# EasyEDA Pro project Flow Meter 3.eprj

# Schematic Schematic1

## Sheets
1 P1: Board Name: Board1; Create Date: 2024-12-02; Page Name: P1; Project Name: Flow Meter 3; Schematic Name: Schematic1; Update Date: 2024-12-02; Company: EasyEDA.com; Drawn: EasyEDA; Page Size: A4; Part Number: JLCPCB-002; Reviewed: EasyEDA; Version: V0.1
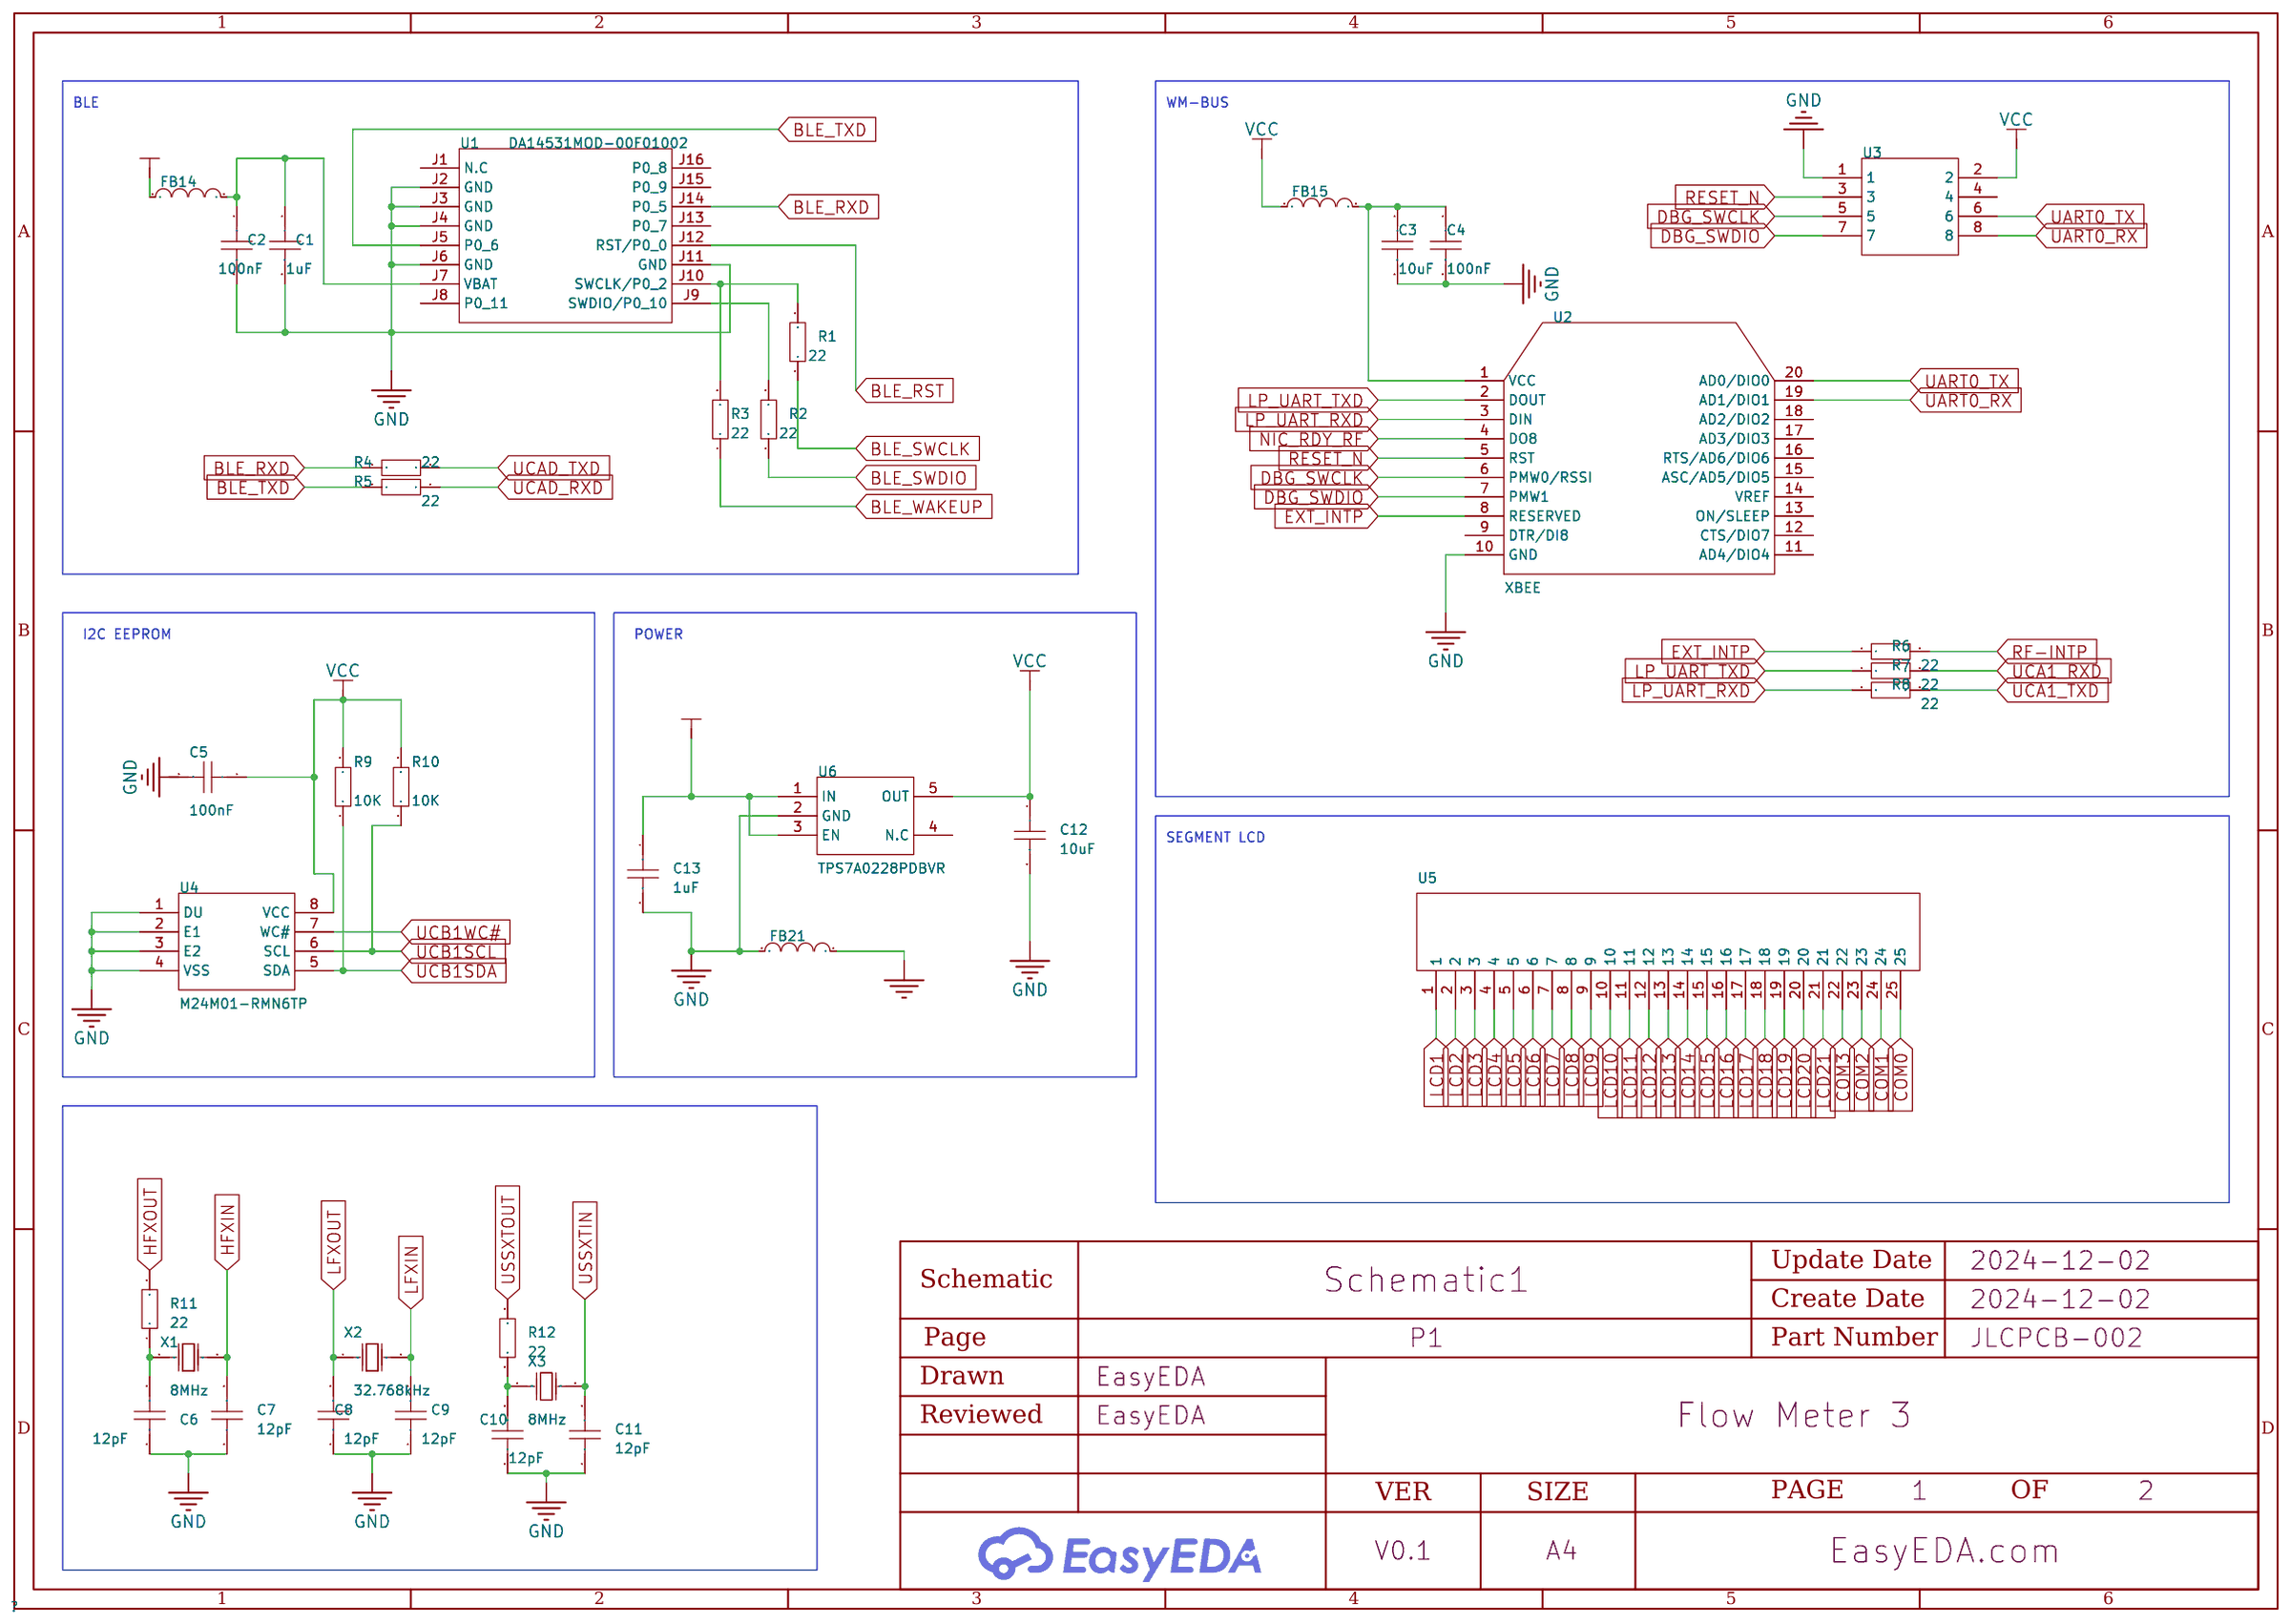
[diagram p0: P1]
2 P2: Page Name: P2; Update Date: 2024-12-03
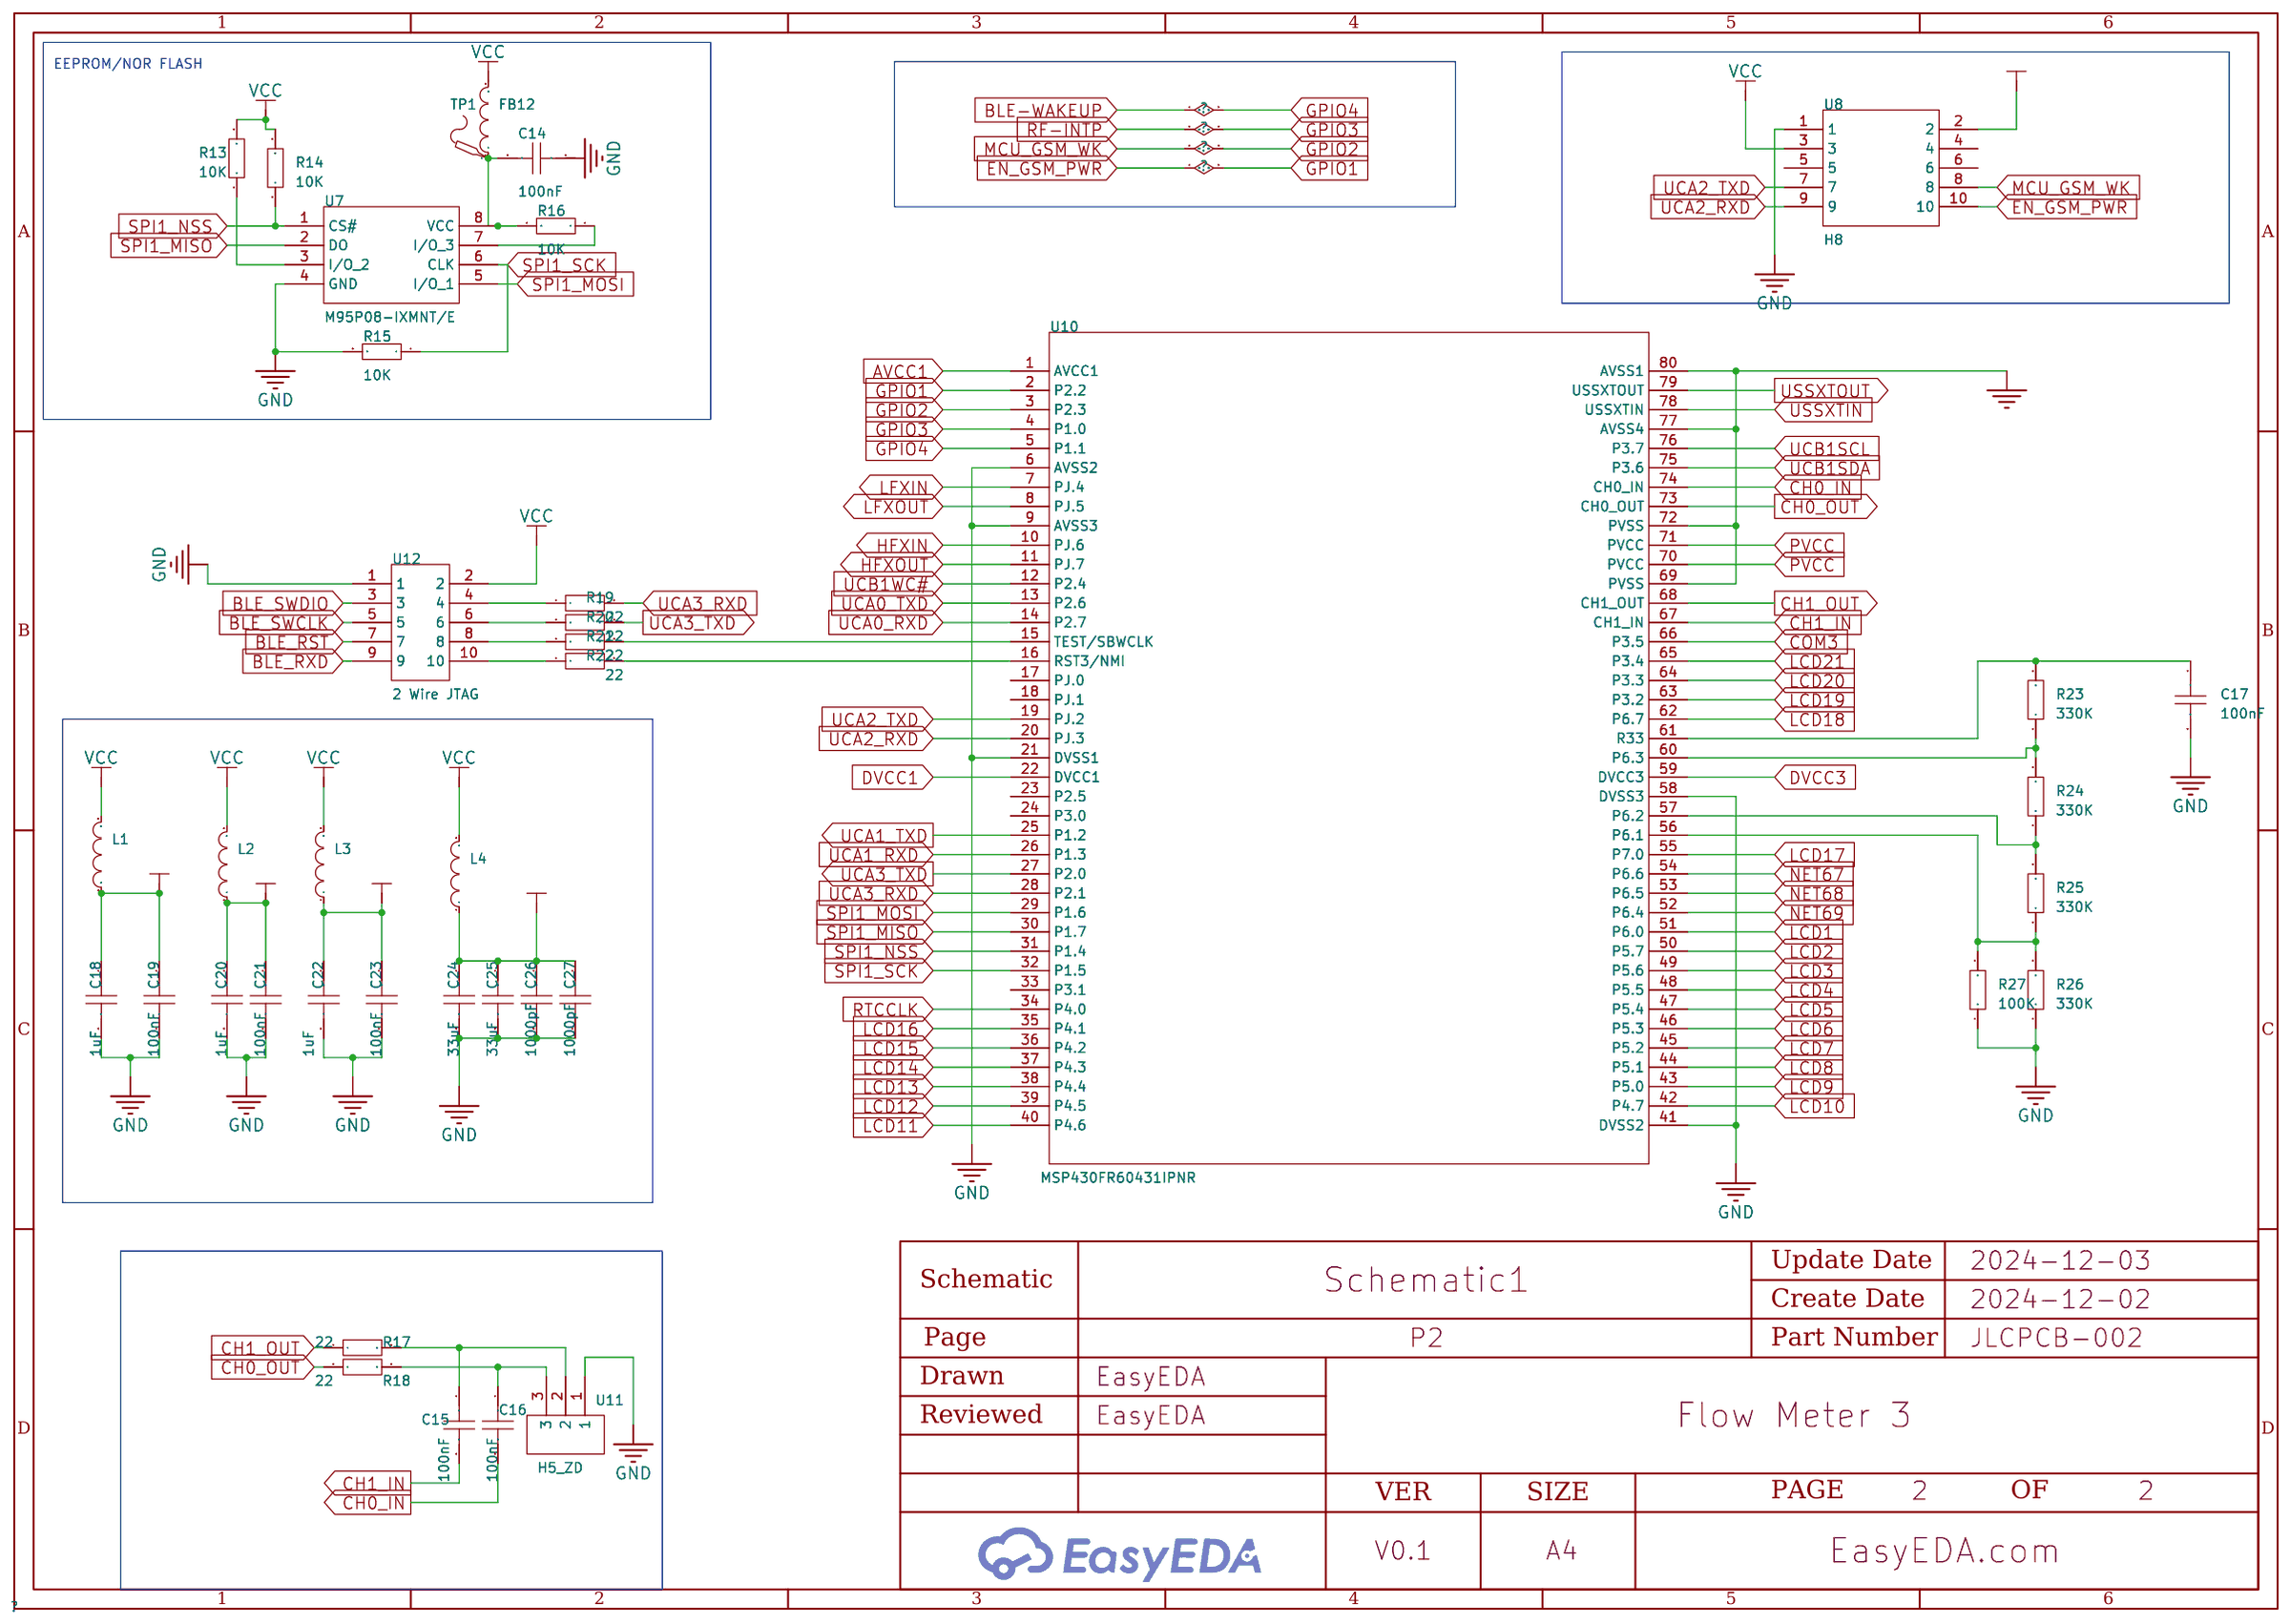
[diagram p1: P2]

## Parts
sheet P1
C1  1uF  [C0603]
C2  100nF  [C0603]
C3  10uF  [C0603]
C4  100nF  [C0603]
C5  100nF  [C0603]
C6  12pF  [C0603]
C7  12pF  [C0603]
C8  12pF  [C0603]
C9  12pF  [C0603]
C10  12pF  [C0603]
C11  12pF  [C0603]
C12  10uF  [C0603]
C13  1uF  [C0603]
FB14  10uH  [L0603]
FB15  10uH  [L0603]
FB21  10uH  [L0603]
R1  22  [R0603]
R2  22  [R0603]
R3  22  [R0603]
R4  22  [R0603]
R5  22  [R0603]
R6  22  [R0603]
R7  22  [R0603]
R8  22  [R0603]
R9  10K  [R0603]
R10  10K  [R0603]
R11  22  [R0603]
R12  22  [R0603]
U1  DA14531MOD-00F01002
U2  XBEE  [XBEE]
U3  -
U4  M24M01-RMN6TP
U5  -  [SEGMENT LCD]
U6  TPS7A0228PDBVR
X1  8MHz  [CRYSTAL-SMD_L11.5-W4.8-LS12.7]
X2  32.768kHz  [CRYSTAL-SMD_L11.5-W4.8-LS12.7]
X3  8MHz  [CRYSTAL-SMD_L11.5-W4.8-LS12.7]
sheet P2
C14  100nF  [C0603]
C15  100nF  [C0603]
C16  100nF  [C0603]
C17  100nF  [C0603]
C18  1uF  [C0603]
C19  100nF  [C0603]
C20  1uF  [C0603]
C21  100nF  [C0603]
C22  1uF  [C0603]
C23  100nF  [C0603]
C24  33uF  [C0603]
C25  33uF  [C0603]
C26  1000pF  [C0603]
C27  1000pF  [C0603]
FB12  10uH  [L0603]
L1  10uH  [L0603]
L2  10uH  [L0603]
L3  10uH  [L0603]
L4  10uH  [L0603]
R13  10K  [R0603]
R14  10K  [R0603]
R15  10K  [R0603]
R16  10K  [R0603]
R17  22  [R0603]
R18  22  [R0603]
R19  22  [R0603]
R20  22  [R0603]
R21  22  [R0603]
R22  22  [R0603]
R23  330K  [R0603]
R24  330K  [R0603]
R25  330K  [R0603]
R26  330K  [R0603]
R27  100K  [R0603]
TP1  -  [Test-Point-0.5mm]
U7  M95P08-IXMNT/E  [EEPROM/NOR FLASH]
U8  H8  [H8]
U10  MSP430FR60431IPNR  [MICROCONTROLLER]
U11  H5_ZD  [H5]
U12  2 Wire JTAG  [JTAG]

## Library data of the parts
C1-C27 = CAP_0603: Supplier Footprint: 0603
FB12 FB14 FB15 FB21 L1-L4 = L_0603
R1-R27 = Res_0603: Supplier Footprint: 0603
U1 = BLE
U2 = WM-BUS
U3 = PZ127V-12-08-0720
U4 = I2C EEPROM
U5 = SEGMENT LCD
U6 = POWER
X1-X3 = X49SM8MSD2SC: Crystal Type:Surface Mount Crystal Frequency: Normal temperature Frequency Tolerance:±20ppm Normal temperature Frequency Tolerance:±20ppm External load capacitor: Frequency Stability(Full temperature range):±30ppm Frequency Stability(Full temperature rang; LCSC Part Name: 8MHz ±20ppm 20pF; Supplier Part: C12674; Manufacturer: YXC(扬兴晶振); Supplier Footprint: HC-49S-SMD; JLCPCB Part Class: Basic Part; Datasheet: https://atta.szlcsc.com/upload/public/pdf/source/20240329/3EBF42EBCAB50CA65B6FA9D7CFA1955A.pdf; Supplier: LCSC; Crystal Type: Surface Mount Crystal; Normal temperature Frequency Tolerance: ±20ppm; Frequency Stability(Full temperature range): ±30ppm
TP1 = Test-Point: Test Point 测试点
U7 = EEPROM/NOR FLASH
U8 = IO EXP
U10 = MSP430FR60431IPNR
U11 = H5_ZD
U12 = 2 Wire JTAG

## Nets
AVCC1: C18.1 C19.1 L1.1 U10.1(AVCC1)
DVCC1: C20.1 C21.1 L2.1 U10.22(DVCC1)
DVCC3: C22.1 C23.1 L3.1 U10.59(DVCC3)
GND: C1.2 C2.2 C3.2 C4.2 C5.2 C6.1 C7.1 C8.1 C9.1 C10.1 C11.1 C12.2 C13.2 C14.1 C17.2 C18.2 C19.2 C20.2 C21.2 C22.2 C23.2 C24.2 C25.2 C26.2 C27.2 FB21.1 R15.2 R26.1 R27.1 U1.J2(GND) U1.J3(GND) U1.J4(GND) U1.J6(GND) U1.J11(GND) U2.10(GND) U3.1 U4.1(DU) U4.2(E1) U4.3(E2) U4.4(VSS) U6.2(GND) U7.4(GND) U8.1 U10.6(AVSS2) U10.9(AVSS3) U10.21(DVSS1) U10.41(DVSS2) U10.58(DVSS3) U11.1 U12.1
PVCC: C24.1 C25.1 C26.1 C27.1 L4.1 U10.70(PVCC) U10.71(PVCC)
VBAT: C13.1 U6.1(IN) U6.3(EN) U8.2
VCC: C5.1 C12.1 FB12.2 FB15.1 L1.2 L2.2 L3.2 L4.2 R9.2 R10.2 R13.2 R14.2 U3.2 U4.8(VCC) U6.5(OUT) U8.3 U12.2
VDD_2V8: FB14.1
BLE-WAKEUP: U10.5(P1.1)
BLE_RST: U1.J12(RST/P0_0) U12.7
BLE_RXD: R4.1 U1.J14(P0_5) U12.9
BLE_SWCLK: R1.1 U12.5
BLE_SWDIO: R2.1 U12.3
BLE_TXD: R5.1 U1.J5(P0_6)
BLE_WAKEUP: R3.1
CH0_IN: C16.2 U10.74(CH0_IN)
CH0_OUT: R18.1 U10.73(CH0_OUT)
CH1_IN: C15.2 U10.67(CH1_IN)
CH1_OUT: R17.1 U10.68(CH1_OUT)
COM0: U5.25
COM1: U5.24
COM2: U5.23
COM3: U5.22 U10.66(P3.5)
DBG_SWCLK: U2.6(PMW0/RSSI) U3.5
DBG_SWDIO: U2.7(PMW1) U3.7
EN_GSM_PWR: U8.10 U10.2(P2.2)
EXT_INTP: R6.1 U2.8(RESERVED)
GPIO2: U8.8 U10.3(P2.3)
GPIO3: R6.2 U10.4(P1.0)
HFXIN: C7.2 U10.10(PJ.6) X1.2(OSC2)
HFXOUT: R11.2 U10.11(PJ.7)
LCD1: U5.1 U10.51(P6.0)
LCD2: U5.2 U10.50(P5.7)
LCD3: U5.3 U10.49(P5.6)
LCD4: U5.4 U10.48(P5.5)
LCD5: U5.5 U10.47(P5.4)
LCD6: U5.6 U10.46(P5.3)
LCD7: U5.7 U10.45(P5.2)
LCD8: U5.8 U10.44(P5.1)
LCD9: U5.9 U10.43(P5.0)
LCD10: U5.10 U10.42(P4.7)
LCD11: U5.11 U10.40(P4.6)
LCD12: U5.12 U10.39(P4.5)
LCD13: U5.13 U10.38(P4.4)
LCD14: U5.14 U10.37(P4.3)
LCD15: U5.15 U10.36(P4.2)
LCD16: U5.16 U10.35(P4.1)
LCD17: U5.17 U10.55(P7.0)
LCD18: U5.18 U10.62(P6.7)
LCD19: U5.19 U10.63(P3.2)
LCD20: U5.20 U10.64(P3.3)
LCD21: U5.21 U10.65(P3.4)
LFXIN: C9.2 U10.7(PJ.4) X2.2(OSC2)
LFXOUT: C8.2 U10.8(PJ.5) X2.1(OSC1)
LP_UART_RXD: R8.1 U2.3(DIN)
LP_UART_TXD: R7.1 U2.2(DOUT)
NET67: U10.54(P6.6)
NET68: U10.53(P6.5)
NET69: U10.52(P6.4)
NIC_RDY_RF: U2.4(DO8)
RESET_N: U2.5(RST) U3.3
RTCCLK: U10.34(P4.0)
SPI1_MISO: U7.2(DO) U10.30(P1.7)
SPI1_MOSI: U7.5(I/O_1) U10.29(P1.6)
SPI1_NSS: R14.1 U7.1(CS#) U10.31(P1.4)
SPI1_SCK: R15.1 U7.6(CLK) U10.32(P1.5)
UART0_RX: U2.19(AD1/DIO1) U3.8
UART0_TX: U2.20(AD0/DIO0) U3.6
UCA0_RXD: U10.14(P2.7)
UCA0_TXD: U10.13(P2.6)
UCA1_RXD: R7.2 U10.26(P1.3)
UCA1_TXD: R8.2 U10.25(P1.2)
UCA2_RXD: U8.9 U10.20(PJ.3)
UCA2_TXD: U8.7 U10.19(PJ.2)
UCA3_RXD: R19.2 U10.28(P2.1)
UCA3_TXD: R20.2 U10.27(P2.0)
UCAD_RXD: R5.2
UCAD_TXD: R4.2
UCB1SCL: R10.1 U4.6(SCL) U10.76(P3.7)
UCB1SDA: R9.1 U4.5(SDA) U10.75(P3.6)
UCB1WC#: U4.7(WC#) U10.12(P2.4)
USS_GND: FB21.2 U10.69(PVSS) U10.72(PVSS) U10.77(AVSS4) U10.80(AVSS1)
USSXTIN: C11.2 U10.78(USSXTIN) X3.2(OSC2)
USSXTOUT: R12.2 U10.79(USSXTOUT)
$1N1426: C3.1 C4.1 FB15.2 U2.1(VCC)
$1N4626: C6.2 R11.1 X1.1(OSC1)
$1N4706: C10.2 R12.1 X3.1(OSC1)
$2N1158: C14.2 FB12.1 R16.2 TP1.1 U7.8(VCC)
$2N1163: R16.1 U7.7(I/O_3)
$2N1454: R13.1 U7.3(I/O_2)
$2N1962: C15.1 R17.2 U11.2
$2N1973: C16.1 R18.2 U11.3
$2N2636: R19.1 U12.4
$2N2645: R20.1 U12.6
$2N2649: R21.1 U12.8
$2N2654: R22.1 U12.10
$2N2659: R22.2 U10.16(RST3/NMI)
$2N2676: R21.2 U10.15(TEST/SBWCLK)
$2N4131: C17.1 R23.2 U10.61(R33)
$2N4149: R24.1 R25.2 U10.57(P6.2)
$2N4154: R25.1 R26.2 R27.2 U10.56(P6.1)
$2N4208: R23.1 R24.2 U10.60(P6.3)
Net-(C1-1): C1.1 C2.1 FB14.2 U1.J7(VBAT)
Net-(R1-2): R1.2 R3.2 U1.J10(SWCLK/P0_2)
Net-(R2-2): R2.2 U1.J9(SWDIO/P0_10)

Not connected (* = marked no-connect by the designer): U1 J1(N.C) J8(P0_11) J13(P0_7) J15(P0_9) J16(P0_8); U2 9(DTR/DI8) 11(AD4/DIO4) 12(CTS/DIO7) 13(ON/SLEEP) 14(VREF) 15(ASC/AD5/DIO5) 16(RTS/AD6/DIO6) 17(AD3/DIO3) 18(AD2/DIO2); U3 4; U6 4(N.C); U8 4 5 6; U10 17(PJ.0) 18(PJ.1) 23(P2.5) 24(P3.0) 33(P3.1)

## Notes on the sheets
sheet 1
- BLE
- WM-BUS
- I2C EEPROM
- POWER
- SEGMENT LCD
sheet 2
- EEPROM/NOR FLASH

# Board PCB1
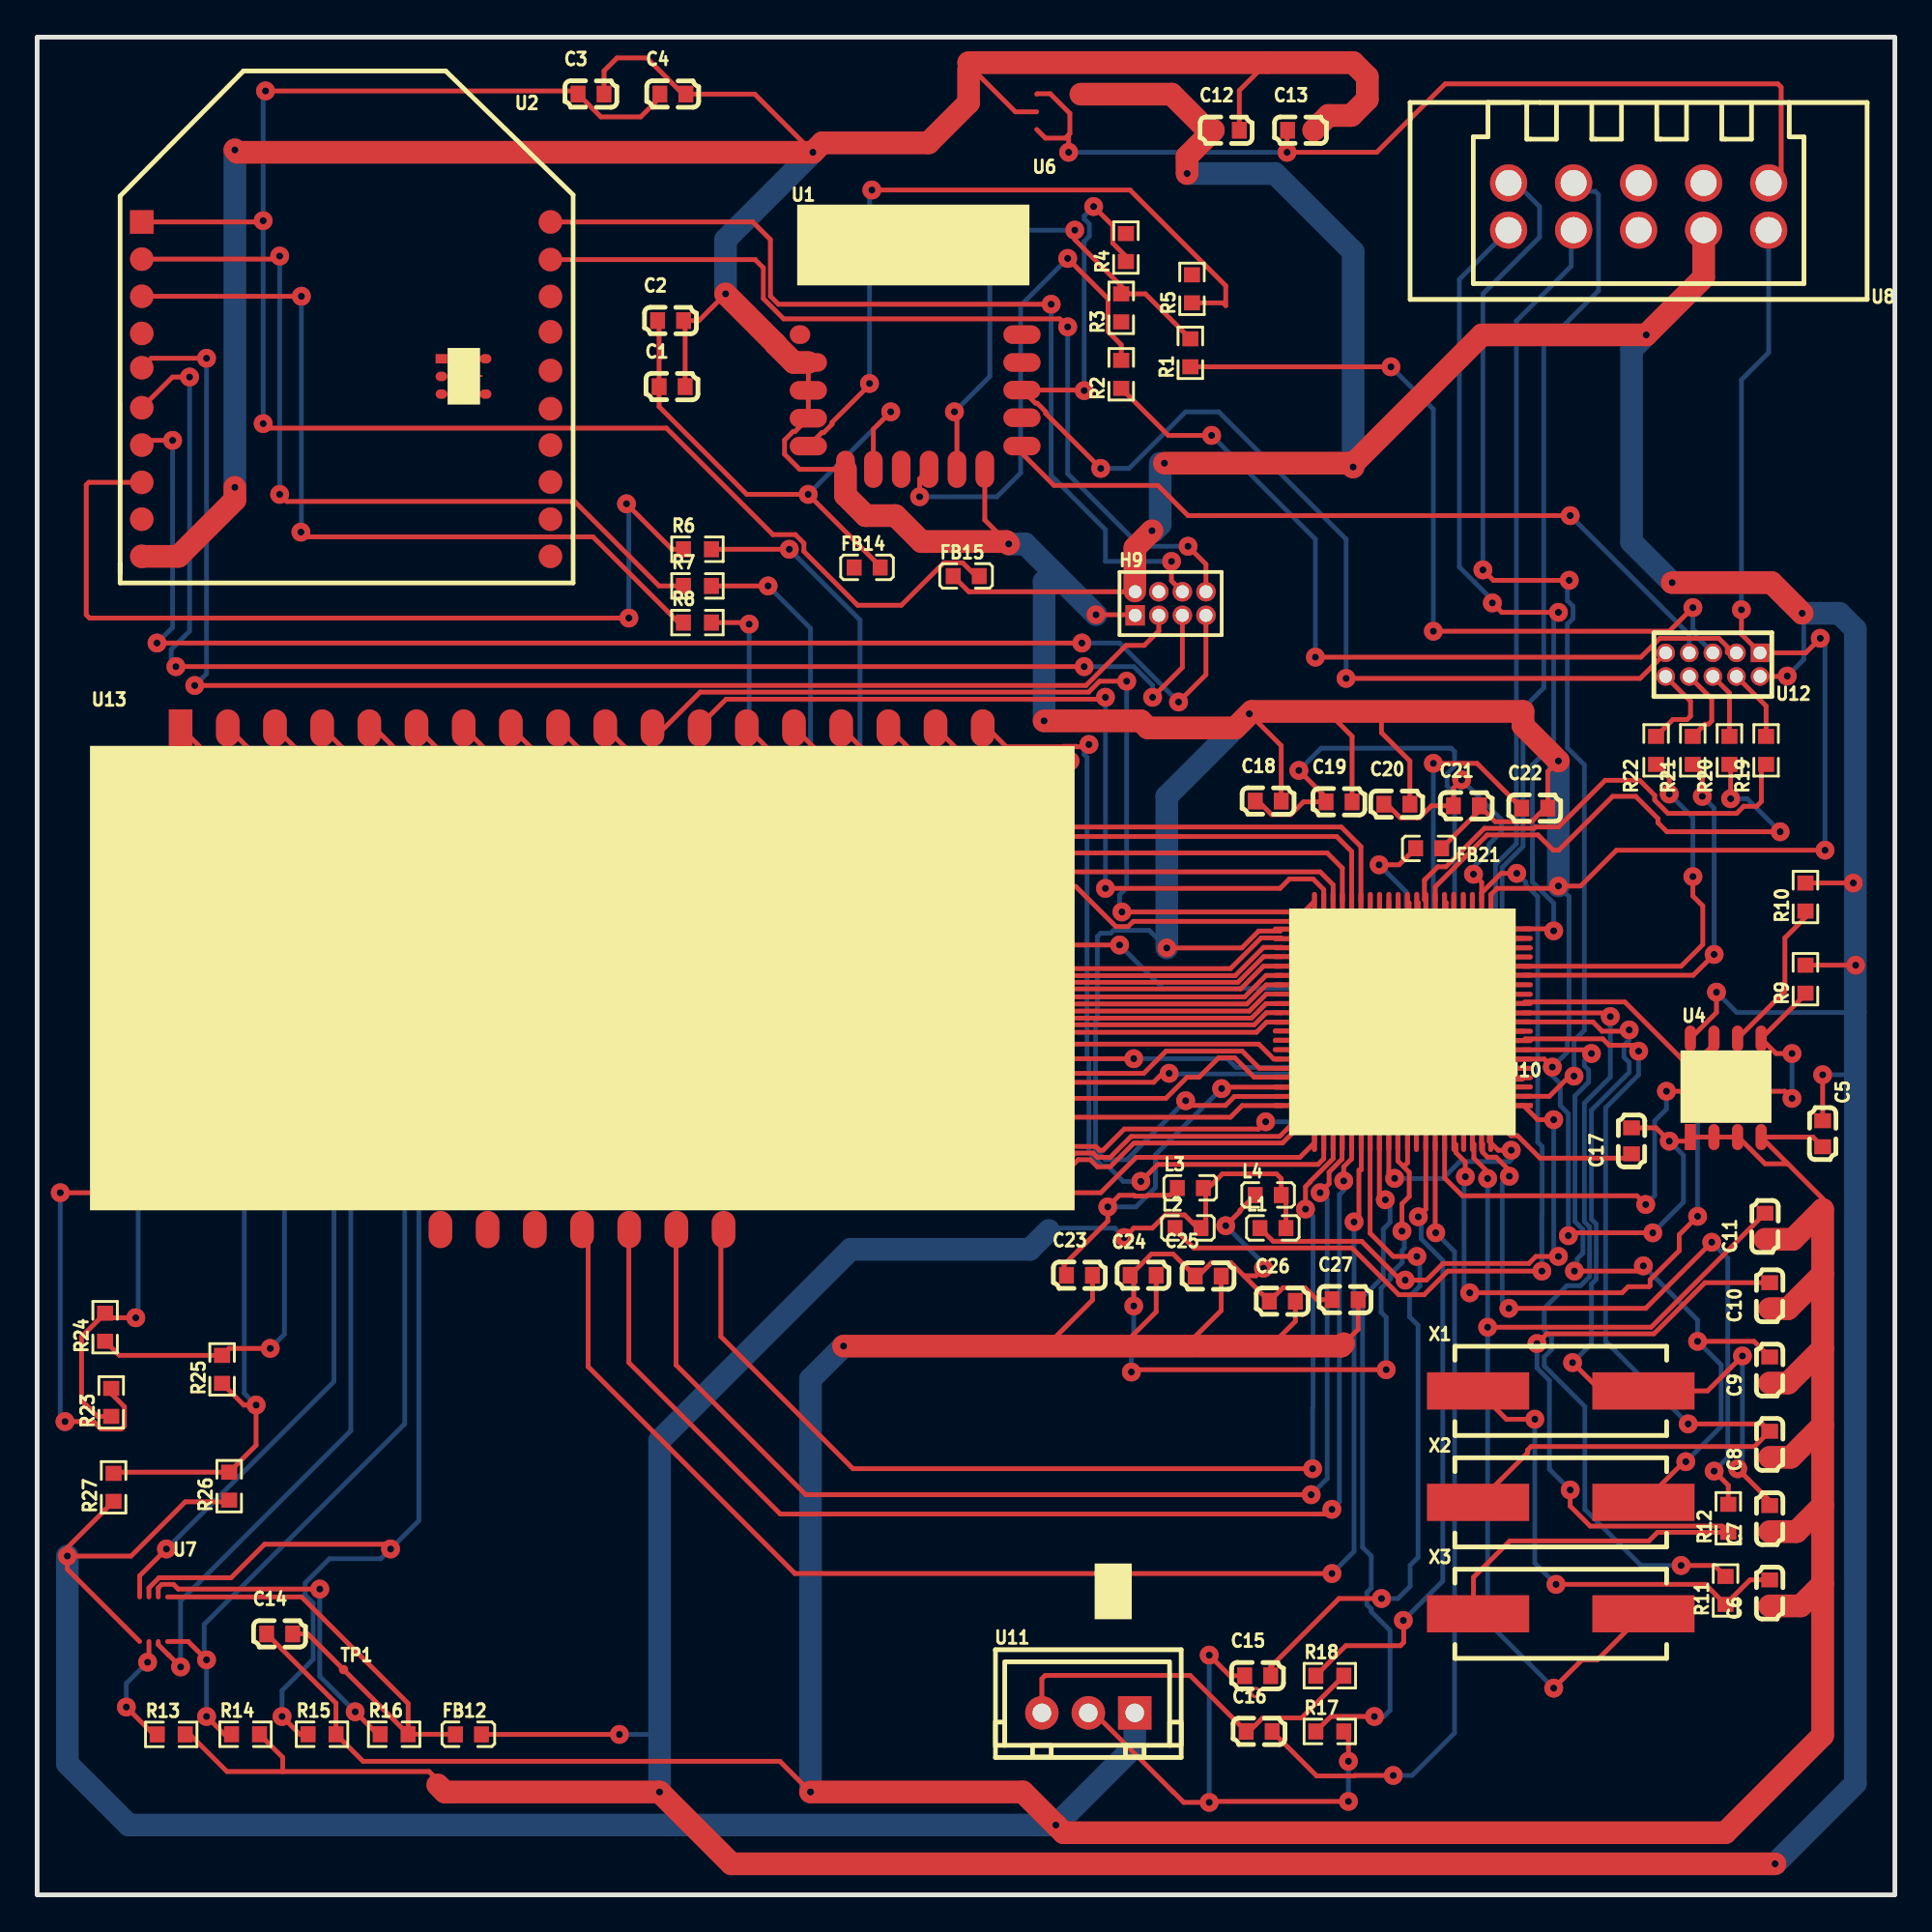
[diagram p2: board, top side]
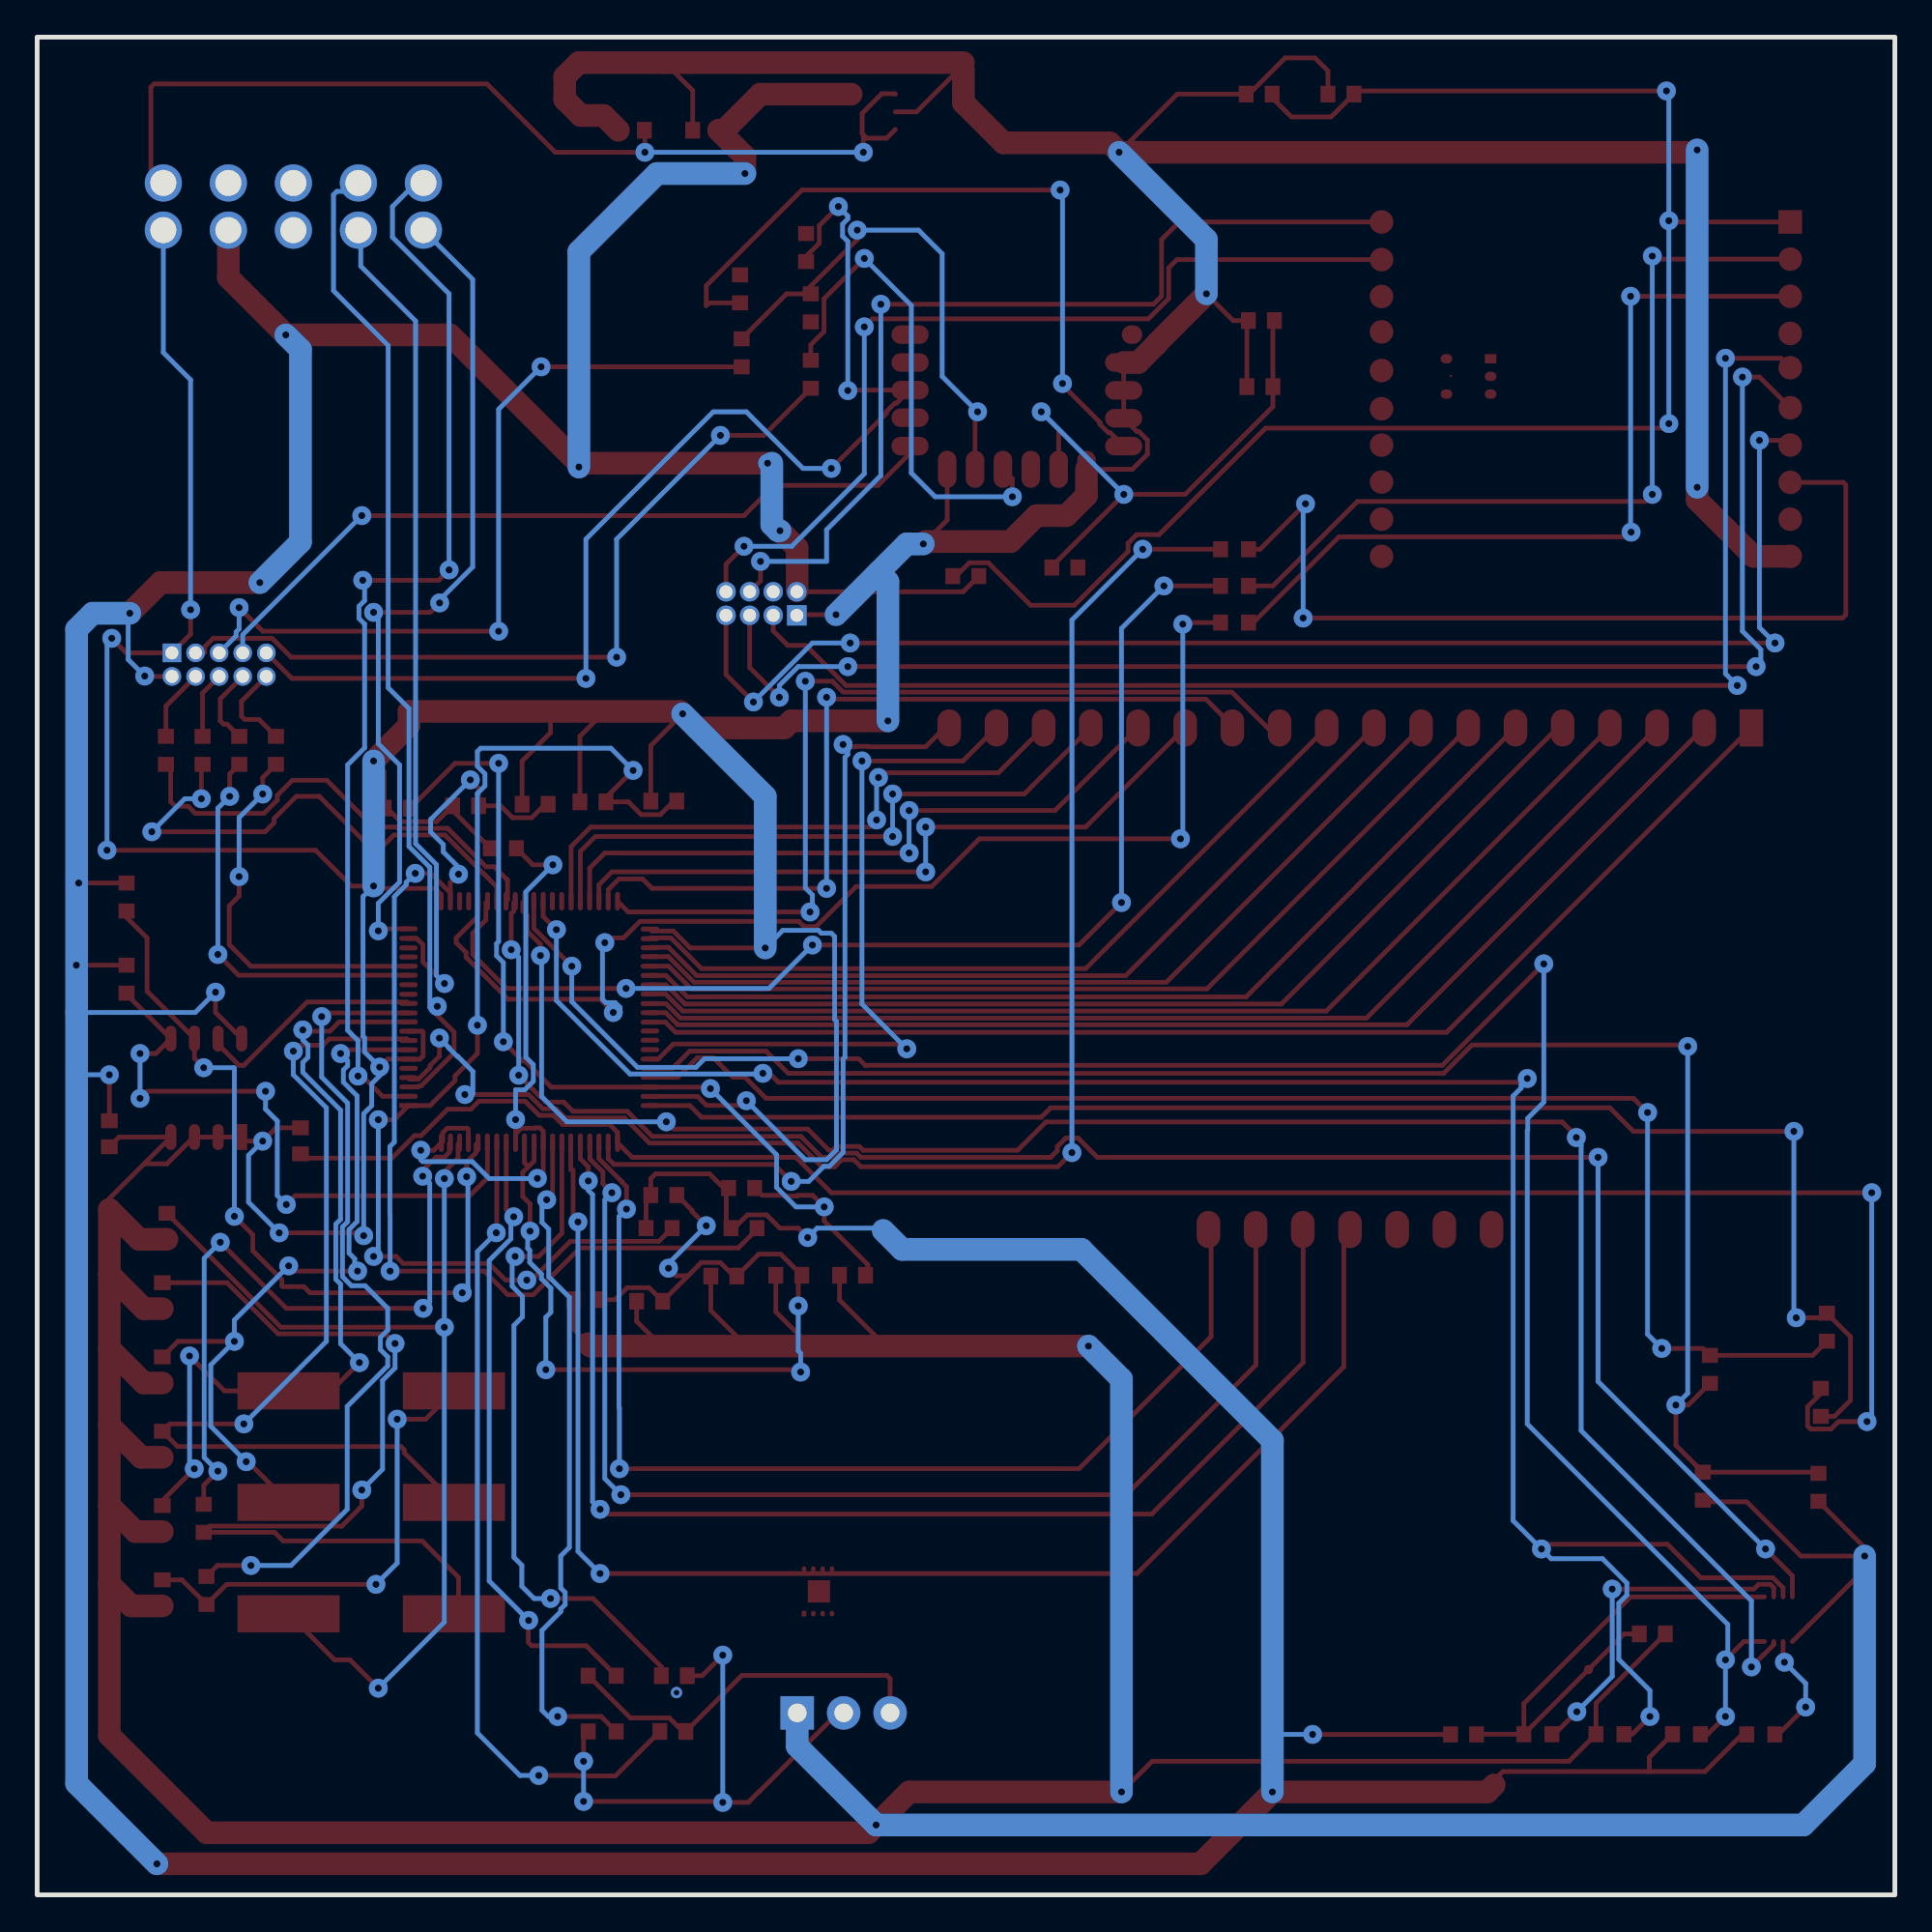
[diagram p3: board, bottom side, seen from below]

Outline 100 x 100 mm; copper layers: Top Layer, Bottom Layer. Coordinates in mm from the lower left corner of the outline.
Outline path: rectangle 0,100 100,0
Stack: Top Layer 0.035mm / Dielectric1 1.51mm FR4 er 4.5 / Bottom Layer 0.035mm

## Design rules (mm)
template: JLCPCB Capability(Two Layers Board)
spacing copperThickness1oz (default): track to track 0.102, other pairs 0.152 to 0.3
spacing copperThickness2oz: track to track 0.203, other pairs 0.152 to 0.3
track width copperThickness1oz (default): min 0.127, default 0.254, max 2.54
track width copperThickness2oz: min 0.203, default 0.254, max 2.54
differential pair differentialPair (default): width min 0.127, default 0.254, max 2.54; gap min 0.152, default 0.152
via viaSize (default): diameter min 0.5, default 0.61, max 10; hole min 0.3, default 0.305, max 6.3

## Placement (name value [footprint] x y rotation side)
C1  1uF  [C0603]  34.18 81.19 0 top
C2  100nF  [C0603]  34.1 84.74 0 top
C3  10uF  [C0603]  29.82 96.94 0 top
C4  100nF  [C0603]  34.22 96.94 0 top
C5  100nF  [C0603]  96.11 40.97 270 top
C6  12pF  [C0603]  93.26 16.25 90 top
C7  12pF  [C0603]  93.26 20.25 90 top
C8  12pF  [C0603]  93.26 24.25 90 top
C9  12pF  [C0603]  93.26 28.25 90 top
C10  12pF  [C0603]  93.26 32.25 90 top
C11  12pF  [C0603]  93.01 35.99 90 top
C12  10uF  [C0603]  64.01 94.99 0 top
C13  1uF  [C0603]  68.01 94.99 0 top
C14  100nF  [C0603]  13.06 14.05 0 top
C15  100nF  [C0603]  65.7 11.8 0 top
C16  100nF  [C0603]  65.78 8.8 0 top
C17  100nF  [C0603]  85.83 40.59 90 top
C18  1uF  [C0603]  66.27 58.88 0 top
C19  100nF  [C0603]  70.08 58.84 0 top
C20  1uF  [C0603]  73.19 58.71 0 top
C21  100nF  [C0603]  76.94 58.62 0 top
C22  1uF  [C0603]  80.62 58.5 0 top
C23  100nF  [C0603]  56.11 33.35 0 top
C24  33uF  [C0603]  59.54 33.35 0 top
C25  33uF  [C0603]  63.04 33.31 0 top
C26  1000pF  [C0603]  67.03 31.95 0 top
C27  1000pF  [C0603]  70.41 32.04 0 top
FB12  10uH  [L0603]  23.22 8.64 0 top
FB14  10uH  [L0603]  44.68 71.45 0 top
FB15  10uH  [L0603]  50.01 70.99 0 top
FB21  10uH  [L0603]  74.9 56.34 180 top
H9  -  [PZ127V-12-08-0720]  61.01 69.51 0 top
L1  10uH  [L0603]  66.52 35.89 0 top
L2  10uH  [L0603]  61.95 35.89 0 top
L3  10uH  [L0603]  62.08 38.05 0 top
L4  10uH  [L0603]  66.27 37.67 0 top
R1  22  [R0603]  62.08 83.01 90 top
R2  22  [R0603]  58.36 81.85 90 top
R3  22  [R0603]  58.36 85.43 90 top
R4  22  [R0603]  58.61 88.67 90 top
R5  22  [R0603]  62.17 86.45 90 top
R6  22  [R0603]  35.54 72.43 0 top
R7  22  [R0603]  35.54 70.46 0 top
R8  22  [R0603]  35.54 68.49 0 top
R9  10K  [R0603]  95.19 49.29 90 top
R10  10K  [R0603]  95.19 53.71 90 top
R11  22  [R0603]  90.88 16.39 90 top
R12  22  [R0603]  91.03 20.27 90 top
R13  10K  [R0603]  7.22 8.64 0 top
R14  10K  [R0603]  11.22 8.65 0 top
R15  10K  [R0603]  15.33 8.65 0 top
R16  10K  [R0603]  19.22 8.65 0 top
R17  22  [R0603]  69.58 8.8 0 top
R18  22  [R0603]  69.58 11.8 0 top
R19  22  [R0603]  93.07 61.61 270 top
R20  22  [R0603]  91.1 61.61 270 top
R21  22  [R0603]  89.12 61.61 270 top
R22  22  [R0603]  87.15 61.61 270 top
R23  330K  [R0603]  3.99 26.51 90 top
R24  330K  [R0603]  3.66 30.56 90 top
R25  330K  [R0603]  9.96 28.29 90 top
R26  330K  [R0603]  10.34 22 90 top
R27  100K  [R0603]  4.11 21.94 90 top
TP1  -  [Test-Point-0.5mm]  16.49 12.12 0 top
U1  DA14531MOD-00F01002  [BLE]  37.01 92.99 0 top
U2  WM-BUS  [XBEE]  54.63 98.05 0 top
U4  M24M01-RMN6TP  [I2C EEPROM]  122.01 94.35 0 top
U6  TPS7A0228PDBVR  [POWER]  55.01 95.99 0 top
U7  M95P08-IXMNT/E  [EEPROM/NOR FLASH]  6.22 14.64 180 top
U8  IO EXP  [H8]  86.21 90.88 180 top
U10  MSP430FR60431IPNR  [MICROCONTROLLER]  30.01 21.99 180 top
U11  H5_ZD  [H5]  56.58 9.8 0 top
U12  2 Wire JTAG  [JTAG]  90.2 66.22 180 top
U13  -  [SEGMENT LCD]  68.68 93.29 0 top
X1  8MHz  [CRYSTAL-SMD_L11.5-W4.8-LS12.7]  82.02 27.13 0 top
X2  32.768kHz  [CRYSTAL-SMD_L11.5-W4.8-LS12.7]  82.02 21.13 0 top
X3  8MHz  [CRYSTAL-SMD_L11.5-W4.8-LS12.7]  82.02 15.13 0 top

## Footprints (pads in the part's own frame, mm; a bottom-side part is the same pattern mirrored in y, then rotated)
BLE
  oval 1.1x1 smd: 1(4.05,-9)
  oval 2x1 smd: 2(4.5,-10.5) 3(4.5,-12) 4(4.5,-13.5) 5(4.5,-15) 12(16,-15) 13(16,-13.474) 14(16,-11.986) 15(16,-10.5) 16(16,-9)
  oval 1x2 smd: 6(6.5,-16.25) 7(8,-16.25) 8(9.5,-16.25) 9(11,-16.25) 10(12.5,-16.25) 11(14,-16.25)
C0603
  rect 0.8x0.9 smd: 1(-0.7,0) 2(0.7,0)
CRYSTAL-SMD_L11.5-W4.8-LS12.7
  rect 5.5x2 smd: 1(-4.45,0) 2(4.45,0)
EEPROM/NOR FLASH
  rect 0.25x0.3 smd: 1(-52.5,-0.5)
  oval 0.25x0.3 smd: 2(-52,-0.5) 3(-51.5,-0.5) 4(-51,-0.5) 5(-51,-2.9) 6(-51.5,-2.9) 7(-52,-2.9) 8(-52.5,-2.9)
H5
  rect 1.8x1.8 hole 1: 1(2.5,0)
  round 1.8 hole 1: 2(0,0) 3(-2.5,0)
H8
  round 2 hole 1.4: 1(-7,1.27) 2(-7,-1.27) 3(-3.5,1.27) 4(-3.5,-1.27) 5(0,1.27) 6(0,-1.27) 7(3.5,1.27) 8(3.5,-1.27) 9(7,1.27) 10(7,-1.27)
I2C EEPROM
  rect 0.6x1.4 smd: 1(-33.02,-53.56)
  oval 0.6x1.4 smd: 2(-31.75,-53.56) 3(-30.48,-53.56) 4(-29.21,-53.56) 5(-29.21,-48.26) 6(-30.479,-48.26) 7(-31.75,-48.26) 8(-33.02,-48.26)
JTAG
  rect 1x1 hole 0.7: 1(-2.54,-0.635)
  round 1 hole 0.7: 2(-2.54,0.635) 3(-1.27,-0.635) 4(-1.27,0.635) 5(0,-0.635) 6(0,0.635) 7(1.27,-0.635) 8(1.27,0.635) 9(2.54,-0.635) 10(2.54,0.635)
L0603
  rect 0.8x0.864 smd: 1(-0.7,0) 2(0.7,0)
MICROCONTROLLER
  rect 1x0.27 smd: 1(-50,-20.5)
  oval 1x0.27 smd: 2(-50,-21) 3(-50,-21.503) 4(-50,-22.003) 5(-50,-22.503) 6(-50,-23.003) 7(-50,-23.503) 8(-50,-24.003) 9(-50,-24.503) 10(-50,-25.003) 11(-50,-25.486) 12(-50,-26) 13(-50,-26.49) 14(-50,-27.003) 15(-50,-27.515) 16(-50,-28) 17(-50,-28.5) 18(-50,-28.988) 19(-50,-29.5) 20(-50,-30.013) 41(-37,-30) 42(-37,-29.48) 43(-37,-28.995) 44(-37,-28.519) 45(-37,-28.004) 46(-37,-27.504) 47(-37,-26.998) 48(-37,-26.503) 49(-37,-25.988) 50(-37,-25.5) 51(-37,-24.99) 52(-37,-24.515) 53(-37,-24.015) 54(-37,-23.509) 55(-37,-23.003) 56(-37,-22.503) 57(-37,-22.028) 58(-37,-20.992) 59(-37,-21.492) 60(-37,-20.5)
  oval 0.27x1 smd: 21(-48.246,-31.5) 22(-47.746,-31.5) 23(-47.246,-31.5) 24(-46.758,-31.5) 25(-46.246,-31.5) 26(-45.746,-31.5) 27(-45.246,-31.5) 28(-44.746,-31.5) 29(-44.252,-31.5) 30(-43.751,-31.5) 31(-43.251,-31.5) 32(-42.751,-31.5) 33(-42.251,-31.5) 34(-41.751,-31.5) 35(-41.246,-31.5) 36(-40.746,-31.5) 37(-40.246,-31.5) 38(-39.746,-31.5) 39(-39.246,-31.5) 40(-38.746,-31.5) 61(-38.746,-18.5) 62(-39.246,-18.5) 63(-39.749,-18.5) 64(-40.239,-18.5) 65(-40.745,-18.5) 66(-41.265,-18.5) 67(-41.741,-18.5) 68(-42.241,-18.5) 69(-42.746,-18.5) 70(-43.237,-18.5) 71(-43.758,-18.5) 72(-44.233,-18.5) 73(-44.739,-18.5) 74(-45.244,-18.5) 75(-45.749,-18.5) 76(-46.255,-18.5) 77(-46.775,-18.5) 78(-47.251,-18.5) 79(-47.742,-18.5) 80(-48.232,-18.5)
POWER
  rect 0.625x0.5 smd: 1(-33.25,-13.3)
  oval 0.625x0.5 smd: 2(-33.25,-14.25) 3(-33.25,-15.2) 4(-30.875,-15.2) 5(-30.875,-13.3)
  oval 0.15x0.1 smd: 6(-31.11,-14.229)
PZ127V-12-08-0720
  rect 1.05x1.1 hole 0.7: 1(-1.905,-0.635)
  round 1.05 hole 0.7: 2(-1.905,0.635) 3(-0.635,-0.635) 4(-0.635,0.635) 5(0.635,-0.635) 6(0.635,0.635) 7(1.905,-0.635) 8(1.905,0.635)
R0603
  rect 0.806x0.864 smd: 1(-0.753,0) 2(0.753,0)
SEGMENT LCD
  rect 1.27x2 smd: 1(-60.96,-30.48)
  oval 1.27x2 smd: 2(-58.42,-30.48) 3(-55.88,-30.48) 4(-53.34,-30.48) 5(-50.8,-30.48) 6(-48.26,-30.48) 7(-45.72,-30.48) 8(-43.18,-30.48) 9(-40.64,-30.48) 10(-38.1,-30.48) 11(-35.56,-30.48) 12(-33.02,-30.48) 13(-30.48,-30.48) 14(-27.94,-30.48) 15(-25.4,-30.48) 16(-22.86,-30.48) 17(-20.32,-30.48) 18(-17.78,-30.48) 19(-31.733,-57.48) 20(-34.272,-57.48) 21(-36.812,-57.48) 22(-39.352,-57.48) 23(-41.892,-57.48) 24(-44.431,-57.48) 25(-46.971,-57.48)
Test-Point-0.5mm
  round 0.5 smd: 1(0,0)
XBEE
  rect 1.27x1.27 smd: 1(-49,-8)
  round 1.27 smd: 2(-49,-10) 3(-49,-12) 4(-49,-14) 5(-49,-15.846) 6(-49,-18) 7(-49,-20.011) 8(-49,-22.017) 9(-49,-24) 10(-49,-26) 11(-27,-26) 12(-27,-24) 13(-27,-22) 14(-27,-20.012) 15(-27,-18.055) 16(-27,-15.998) 17(-27,-13.915) 18(-27,-12.009) 19(-27,-10.027) 20(-27,-8)

## Nets
AVCC1: C18.1 C19.1 L1.1 U10.1
DVCC1: C20.1 C21.1 L2.1 U10.22
DVCC3: C22.1 C23.1 L3.1 U10.59
GND: C1.2 C2.2 C3.2 C4.2 C5.2 C6.1 C7.1 C8.1 C9.1 C10.1 C11.1 C12.2 C13.2 C14.1 C17.2 C18.2 C19.2 C20.2 C21.2 C22.2 C23.2 C24.2 C25.2 C26.2 C27.2 FB21.1 H9.1 R15.2 R26.1 R27.1 U1.2 U1.3 U1.4 U1.6 U1.11 U2.10 U4.1 U4.2 U4.3 U4.4 U6.2 U7.4 U8.1 U10.6 U10.9 U10.21 U10.41 U10.58 U11.1 U12.1
PVCC: C24.1 C25.1 C26.1 C27.1 L4.1 U10.70 U10.71
VBAT: C13.1 U6.1 U6.3 U8.2
VCC: C5.1 C12.1 FB12.2 FB15.1 H9.2 L1.2 L2.2 L3.2 L4.2 R9.2 R10.2 R13.2 R14.2 U4.8 U6.5 U8.3 U12.2
VDD_2V8: FB14.1
BLE-WAKEUP: U10.5
BLE_RST: U1.12 U12.7
BLE_RXD: R4.1 U1.14 U12.9
BLE_SWCLK: R1.1 U12.5
BLE_SWDIO: R2.1 U12.3
BLE_TXD: R5.1 U1.5
BLE_WAKEUP: R3.1
CH0_IN: C16.2 U10.74
CH0_OUT: R18.1 U10.73
CH1_IN: C15.2 U10.67
CH1_OUT: R17.1 U10.68
COM0: U13.25
COM1: U13.24
COM2: U13.23
COM3: U10.66 U13.22
DBG_SWCLK: H9.5 U2.6
DBG_SWDIO: H9.7 U2.7
EN_GSM_PWR: U8.10 U10.2
EXT_INTP: R6.1 U2.8
GPIO2: U8.8 U10.3
GPIO3: R6.2 U10.4
HFXIN: C7.2 U10.10 X1.2
HFXOUT: R11.2 U10.11
LCD1: U10.51 U13.1
LCD2: U10.50 U13.2
LCD3: U10.49 U13.3
LCD4: U10.48 U13.4
LCD5: U10.47 U13.5
LCD6: U10.46 U13.6
LCD7: U10.45 U13.7
LCD8: U10.44 U13.8
LCD9: U10.43 U13.9
LCD10: U10.42 U13.10
LCD11: U10.40 U13.11
LCD12: U10.39 U13.12
LCD13: U10.38 U13.13
LCD14: U10.37 U13.14
LCD15: U10.36 U13.15
LCD16: U10.35 U13.16
LCD17: U10.55 U13.17
LCD18: U10.62 U13.18
LCD19: U10.63 U13.19
LCD20: U10.64 U13.20
LCD21: U10.65 U13.21
LFXIN: C9.2 U10.7 X2.2
LFXOUT: C8.2 U10.8 X2.1
LP_UART_RXD: R8.1 U2.3
LP_UART_TXD: R7.1 U2.2
NET67: U10.54
NET68: U10.53
NET69: U10.52
NIC_RDY_RF: U2.4
RESET_N: H9.3 U2.5
RTCCLK: U10.34
SPI1_MISO: U7.2 U10.30
SPI1_MOSI: U7.5 U10.29
SPI1_NSS: R14.1 U7.1 U10.31
SPI1_SCK: R15.1 U7.6 U10.32
UART0_RX: H9.8 U2.19
UART0_TX: H9.6 U2.20
UCA0_RXD: U10.14
UCA0_TXD: U10.13
UCA1_RXD: R7.2 U10.26
UCA1_TXD: R8.2 U10.25
UCA2_RXD: U8.9 U10.20
UCA2_TXD: U8.7 U10.19
UCA3_RXD: R19.2 U10.28
UCA3_TXD: R20.2 U10.27
UCAD_RXD: R5.2
UCAD_TXD: R4.2
UCB1SCL: R10.1 U4.6 U10.76
UCB1SDA: R9.1 U4.5 U10.75
UCB1WC#: U4.7 U10.12
USS_GND: FB21.2 U10.69 U10.72 U10.77 U10.80
USSXTIN: C11.2 U10.78 X3.2
USSXTOUT: R12.2 U10.79
$1N524: R1.2 R3.2 U1.10
$1N575: R2.2 U1.9
$1N674: C1.1 C2.1 FB14.2 U1.7
$1N1426: C3.1 C4.1 FB15.2 U2.1
$1N4626: C6.2 R11.1 X1.1
$1N4706: C10.2 R12.1 X3.1
$2N1158: C14.2 FB12.1 R16.2 TP1.1 U7.8
$2N1163: R16.1 U7.7
$2N1454: R13.1 U7.3
$2N1962: C15.1 R17.2 U11.2
$2N1973: C16.1 R18.2 U11.3
$2N2636: R19.1 U12.4
$2N2645: R20.1 U12.6
$2N2649: R21.1 U12.8
$2N2654: R22.1 U12.10
$2N2659: R22.2 U10.16
$2N2676: R21.2 U10.15
$2N4131: C17.1 R23.2 U10.61
$2N4149: R24.1 R25.2 U10.57
$2N4154: R25.1 R26.2 R27.2 U10.56
$2N4208: R23.1 R24.2 U10.60

Pads without a net: H9 4; U1 1 8 13 15 16; U2 9 11 12 13 14 15 16 17 18; U6 4 6; U8 4 5 6; U10 17 18 23 24 33

## Via types
v1: diameter 0.61, hole 0.305, Top Layer to Bottom Layer, 1 via
v2: diameter 1.016, hole 0.381, Top Layer to Bottom Layer, 229 vias

## Routing (per net, layer and track width the routed paths; a pad name or vN(x,y) marks a point on that pad's centre or on a via; arc(x,y) is an arc through that point)
AVCC1: length 64.6
  Top Layer w0.254: v2(76.3,46.81) 76.3,45.29 77.51,44.08 77.51,43.83 78.85,42.49 U10.1 80.77,41.73 v2(81.64,41.73) ; C18.1 65.61,58.84 65.77,58.84 66.45,58.15 67.48,58.15 68.17,58.84 C19.1 69.38,59.06 v2(67.92,60.53) ; L1.1 66.53,35.18 71.3,35.18 73.39,33.09 v2(73.64,33.09) 74.79,33.09 75.68,33.99 80.3,33.99 80.67,34.36 81.89,34.36 v2(81.89,34.37)
  Bottom Layer w0.254: v2(81.89,34.37) 81.64,34.37 v2(81.64,41.73) ; v2(76.3,46.81) 76.3,59.29 75.9,59.69 75.9,60.35 76.3,60.75 76.3,61.54 76.12,61.72 69.11,61.72 v2(67.92,60.53)
DVCC1: length 60.3
  Top Layer w0.254: 77.76,53.94 78.81,54.99 v2(79.65,54.99) ; 77.76,53.94 77.76,54.5 v2(77.32,54.94) ; 77.76,53.94 U10.22 ; v2(76.68,60.02) 76.24,59.57 C21.1 75.05,58.62 74.41,57.98 73.38,57.98 72.73,58.62 72.58,58.62 C20.1 ; v2(81,33.58) 75.93,33.58 74.66,32.3 73.3,32.3 70.78,34.82 62.26,34.82 61.19,35.89
  Bottom Layer w0.254: v2(77.32,54.94) 77.32,55.07 77.19,55.19 78.14,56.14 78.14,56.53 78.82,57.22 78.82,57.88 v2(76.68,60.02) ; v2(79.65,54.99) 80.14,54.5 80.14,54.37 80.77,53.73 80.77,40.52 81.01,40.28 81.01,36.63 81,36.62 v2(81,33.58)
DVCC3: length 51.8
  Top Layer w0.254: v2(75.16,60.91) 77.51,60.91 C22.1 ; v2(63.76,43.4) 63.84,43.48 U10.59 72.33,43.48 73.75,44.91 73.89,44.91 v2(74.9,45.92) ; C23.1 55.28,33.48 55.28,33.92 57.63,36.27 v2(57.63,37.03) 58.26,37.66 59.05,37.66 59.08,37.62 59.74,37.62 59.78,37.66 60.99,37.66 L3.1
  Bottom Layer w0.254: v2(57.63,37.03) 59.15,37.03 60.2,38.08 60.2,39.84 v2(63.76,43.4) ; v2(75.16,60.91) 75.16,51.31 75.27,51.2 75.27,50.55 74.9,50.19 v2(74.9,45.92)
GND: length 708.1
  Top Layer w0.254: v2(37.06,86.18) 35.62,84.74 C2.2 34.88,84.66 C1.2 ; C27.2 71.11,30.45 70.33,29.67 ; v2(82.42,35.48) 82.58,35.64 v2(86.97,35.64) ; v2(60.81,50.97) 64.84,50.97 65.75,51.88 66.91,51.88 U10.41 ; v2(81.56,44.56) 81.13,44.99 U10.6 80,44.98 79.4,44.98 79.22,45.16 79.22,46.43 79.28,46.49 U10.9 ; C26.2 67.73,30.88 66.78,29.92 ; v2(61.82,42.75) 62.08,42.49 63.97,42.49 64.45,42.98 U10.58 ; C20.2 73.89,61.03 72.36,62.56 72.36,63.58 ; v2(1.63,18.24) 1.63,17.53 5.52,13.64 ; v2(1.63,18.24) 1.5,18.36 1.5,18.57 R27.1 ; v2(1.63,18.24) 5.05,18.24 7.98,21.16 10.25,21.16 R26.1 ; v2(96.24,56.23) 85.01,56.23 83.08,54.31 v2(81.89,54.31) 81.76,54.18 78.59,54.18 78.26,53.85 U10.21 ; U1.2 U1.3 U1.4 40.79,78.77 40.69,78.77 40.23,78.31 40.23,77.55 41.04,76.74 U1.6 ; 94.22,39.37 96.11,37.48 96.11,36.89 ; 94.22,39.37 U4.4 95.59,40.79 C5.2 ; 94.22,39.37 94.2,39.35 93.01,39.35 91.57,40.79 U4.3 U4.2 U4.1 88.77,40.57 v2(87.86,40.57) 87.14,41.29 C17.2 ; v2(57,68.91) 59.07,68.91 H9.1 ; 52.17,72.85 51.01,74.01 U1.11 ; v2(95.99,67.64) 95.2,66.86 U12.1 91.74,67.86 v2(91.74,69.18) ; 50.27,98.37 52.66,95.98 53.81,95.98 ; 50.27,98.37 50.32,98.43 ; 50.27,98.37 50.21,98.43 ; v2(41.76,93.8) 38.62,96.94 C4.2 34.76,96.94 32.82,98.88 31.22,98.88 30.52,98.18 C3.2 ; v2(65.25,63.58) 66.97,61.86 C18.2 ; C24.2 60.24,31.38 58.65,29.79 ; 66.21,98.63 64.71,97.13 C12.2 ; C19.2 70.78,62.36 69.82,63.32 ; C25.2 63.74,31.45 62.2,29.92 ; C14.1 16.09,10.31 R15.2 17.55,7.19 39.98,7.19 v2(41.63,5.54) ; FB21.1 77.64,58.37 C21.2 78.49,57.77 80.44,57.77 81.16,58.5 C22.2 81.32,60.47 v2(81.89,61.04) ; 54.84,30.05 56.81,32.02 C23.2
  Top Layer w1.219: 96.11,20.96 94.71,19.55 C7.1 ; 96.11,20.96 96.11,16.74 ; 96.11,20.96 96.11,25.27 ; 62.2,29.54 v2(43.41,29.54) ; v2(54.2,63.2) 59.41,63.2 59.79,62.81 64.49,62.81 v2(65.25,63.58) 65.38,63.7 79.98,63.7 79.98,62.94 v2(81.89,61.04) ; C6.1 94.93,15.55 96.11,16.74 ; C13.2 69.51,95.79 70.74,95.79 71.6,96.65 71.6,97.87 70.84,98.63 50.14,98.63 ; 50.14,98.25 50.14,96.47 47.98,94.31 42.27,94.31 v2(41.76,93.8) 10.77,93.8 v2(10.64,93.93) ; 62.46,29.54 70.21,29.54 70.33,29.67 ; 96.11,29.41 94.26,27.55 C9.1 ; 96.11,29.41 96.11,33.41 ; 96.11,29.41 96.11,25.27 ; 96.11,33.41 94.25,31.55 C10.1 ; 96.11,33.41 96.11,36.89 94.51,35.29 C11.1 ; 96.11,25.27 94.39,23.55 C8.1 ; 96.11,16.74 96.11,8.59 90.87,3.34 55.25,3.34 v2(54.84,3.76) 53.06,5.54 v2(41.63,5.54) ; U2.10 7.61,72.05 10.64,75.09 v2(10.64,75.77) ; U1.2 40.73,82.49 39.75,83.47 39.75,83.49 v2(37.06,86.18) ; U1.6 43.51,75.33 44.6,74.24 46.2,74.24 47.6,72.85 52.17,72.85 v2(52.3,72.72)
  Bottom Layer w0.254: v2(96.24,56.23) 96.24,67.77 96.11,67.64 v2(95.99,67.64) ; 82.42,35.49 82.42,42.05 81.99,42.48 81.99,43.66 81.56,44.09 v2(81.56,44.56) 82.37,45.37 82.37,46.13 82.46,46.22 82.46,53.74 v2(81.89,54.31) ; v2(91.74,69.18) 91.74,81.56 93.21,83.02 U8.1 ; v2(61.82,42.75) 58.65,39.57 57.51,39.57 56.97,40.11 56.97,47.02 57.07,47.12 57.07,51.59 57.25,51.77 57.79,51.77 57.94,51.92 59.86,51.92 v2(60.81,50.97) ; v2(86.97,35.64) 88.62,37.29 88.62,39.81 v2(87.86,40.57)
  Bottom Layer w1.219: 54.71,71.2 54.2,70.69 v2(54.2,63.2) ; 54.71,71.2 v2(57,68.91) ; 54.71,71.2 53.19,72.72 v2(52.3,72.72) ; v2(41.76,93.8) 37.06,89.1 v2(37.06,86.18) ; v2(1.63,18.24) 1.63,7.06 4.93,3.76 v2(54.84,3.76) 59.08,8.01 U11.1 ; v2(10.64,93.93) v2(10.64,75.77) ; v2(43.41,29.54) 41.63,27.76 v2(41.63,5.54) ; v2(60.81,50.97) 60.81,59.13 v2(65.25,63.58) ; v2(81.89,61.04) v2(81.89,54.31)
PVCC: length 54
  Top Layer w0.254: 64.96,33.32 C26.1 67.06,32.68 68.25,32.68 68.89,32.04 C27.1 ; 64.96,33.32 64.42,33.87 64.42,33.87 64.25,34.04 63.22,34.04 62.49,33.31 62.34,33.31 61.15,34.49 59.98,34.49 58.84,33.35 59.03,33.16 v2(59.03,31.7) ; 64.96,33.32 65.61,33.32 v2(66.01,33.73) ; v2(73.47,35.73) 73.47,37.2 73.86,37.59 73.86,38.89 73.56,39.2 ; v2(72.62,28.27) 59.03,28.27 v2(58.9,28.14) ; 73.56,39.2 73.25,39.5 U10.70 ; 73.56,39.2 73.77,39.41 73.77,40.49 ; L4.1 64.74,36.84 64.74,36.78 v2(63.98,36.02)
  Bottom Layer w0.254: v2(72.62,28.27) 72.62,31.09 72.35,31.36 72.35,32.66 72.86,33.17 72.86,33.42 73.48,34.04 73.48,34.69 73.6,34.81 73.6,35.6 v2(73.47,35.73) ; v2(66.01,33.73) 66.01,33.99 v2(63.98,36.02) ; v2(58.9,28.14) 58.9,29.16 59.03,29.29 v2(59.03,31.7)
VBAT: length 52.9
  Top Layer w0.254: 53.81,96.93 53.83,96.95 54.53,96.95 55.59,95.9 55.59,94.81 55.53,94.74 ; 53.81,95.03 54.27,94.56 55.35,94.56 55.53,94.74 ; 55.53,94.74 v2(55.53,93.8) ; C13.1 67.28,94.96 v2(67.28,93.8) 72.11,93.8 75.79,97.49 93.7,97.49 93.88,97.31 93.88,92.82 U8.2
  Bottom Layer w0.254: v2(55.53,93.8) v2(67.28,93.8)
VCC: length 368.7
  Top Layer w0.254: v2(31.34,8.64) FB12.2 ; U4.8 90.4,47.5 v2(90.4,48.59) ; R9.2 v2(97.89,50.04) ; 13.22,6.64 21.1,6.64 21.28,6.46 21.28,6.2 ; 13.22,6.64 13.22,7.4 R14.2 ; 13.22,6.64 10.22,6.64 8.22,8.64 ; L1.2 67.22,37.41 L4.2 66.97,38.56 66.71,38.81 63.81,38.81 62.9,37.91 62.9,36.14 L2.2 62.48,35.89 61.77,36.6 60.73,36.6 60.02,35.89 59.03,35.89 v2(58.52,35.38) ; R10.2 v2(97.76,54.47) ; FB15.1 50.15,70.15 H9.2 ; v2(94.21,65.61) 94.19,65.59 U12.2 ; C5.1 v2(96.11,44.15)
  Top Layer w1.219: v2(60.68,77.07) 70.63,77.07 70.81,76.89 ; 59.09,70.19 59.09,72.51 v2(60.01,73.43) ; v2(61.9,92.66) 61.9,93.58 C12.1 63.01,94.99 61.07,96.93 56.18,96.93 ; 70.81,76.89 v2(70.84,76.86) ; 70.81,76.89 70.81,77 77.77,83.97 v2(86.62,83.97) 89.71,87.06 U8.3 ; 21.56,5.92 21.95,5.54 v2(33.51,5.54) 37.37,1.67 v2(93.55,1.67) ; v2(95.01,68.99) 93.36,70.64 v2(88.01,70.64)
  Bottom Layer w0.254: v2(90.4,48.59) 91.49,47.5 97.87,47.5 ; 54.58,35.89 58.01,35.89 v2(58.52,35.38) ; v2(94.21,65.61) 95.1,66.5 95.1,68.78 ; v2(31.34,8.64) 33.25,8.64 ; v2(96.11,44.15) 97.64,44.15
  Bottom Layer w1.219: v2(86.62,83.97) 85.83,83.18 85.83,72.82 v2(88.01,70.64) ; 60.45,77.07 60.45,73.76 60.12,73.43 v2(60.01,73.43) ; v2(61.9,92.66) 66.63,92.66 70.84,88.45 v2(70.84,76.86) ; v2(95.01,68.99) 97.01,68.99 97.87,68.13 97.87,5.99 v2(93.55,1.67) ; 54.46,35.76 53.44,34.75 43.79,34.75 33.51,24.46 v2(33.51,5.54)
(no net):
  vias: v1(65.58,10.89)
BLE_RST: length 41.3
  Top Layer w0.254: v2(82.52,74.24) 61.95,74.24 60.32,75.87 54.74,75.87 53.01,77.59 U1.12
  Bottom Layer w0.254: U12.7 88.93,67.84 v2(82.52,74.24)
BLE_RXD: length 66
  Top Layer w0.254: U12.9 86.29,65.48 v2(70.46,65.48) ; 53.03,81 56.34,81 v2(56.36,80.98) ; 53.03,81 U1.14 ; 53.03,81 53.74,80.29 53.83,80.29 54.29,79.84 54.29,79.74 v2(57.25,76.78) ; v2(56.87,90.88) 57.9,89.85 57.9,88.91 58.61,88.2 R4.1
  Bottom Layer w0.254: v2(57.25,76.78) 58.78,76.78 61.82,79.83 63.6,79.83 70.46,72.97 v2(70.46,65.48) ; v2(56.87,90.88) 56.36,90.37 56.36,90.22 56.64,89.94 56.64,89.29 56.36,89.01 v2(56.36,80.98)
BLE_SWCLK: length 43.4
  Top Layer w0.254: v2(89.13,69.29) 87.86,68.02 v2(75.16,68.02) ; R1.1 v2(72.87,82.25)
  Bottom Layer w0.254: U12.5 89.29,67.77 89.29,67.98 89.13,68.14 v2(89.13,69.29) ; v2(72.87,82.25) 75.16,79.97 v2(75.16,68.02)
BLE_SWDIO: length 43.7
  Top Layer w0.254: v2(63.22,78.56) 60.89,78.56 R2.1 ; U12.3 91.01,66.86 90.98,66.88 90.98,67.18 90.53,67.64 87.34,67.64 86.33,66.62 v2(68.81,66.62)
  Bottom Layer w0.254: v2(68.81,66.62) 68.81,72.97 v2(63.22,78.56)
BLE_TXD: length 39.4
  Top Layer w0.254: U1.5 42.23,78.71 42.33,78.71 42.79,79.17 42.79,79.27 44.81,81.28 v2(44.81,81.36) ; v2(44.93,91.77) 58.83,91.77 63.98,86.62 63.98,85.55 63.83,85.7 R5.1
  Bottom Layer w0.254: v2(44.81,81.36) 44.81,91.64 v2(44.93,91.77)
CH0_IN: length 43.9
  Top Layer w0.254: v2(73,6.43) 70.94,6.43 70.91,6.4 68.87,6.4 C16.2 ; v2(75.29,35.64) 75.26,35.67 U10.74
  Bottom Layer w0.254: 73.13,6.43 74.02,6.43 76.3,8.71 76.3,34.62 v2(75.29,35.64)
CH0_OUT: length 34
  Top Layer w0.254: R18.1 70.45,13.41 73.38,13.41 73.56,13.59 73.56,14.76 v2(73.54,14.77) ; U10.73 74.75,36.9 v2(74.35,36.5)
  Bottom Layer w0.254: v2(74.35,36.5) 74.5,36.35 74.5,35.31 75.67,34.15 75.67,16.9 v2(73.54,14.77)
CH1_IN: length 36.1
  Top Layer w0.254: C15.2 66.4,12.27 70.08,15.95 v2(72.36,15.95) ; U10.67 71.75,35.61 73,34.37 v2(74.27,34.37)
  Bottom Layer w0.254: v2(72.36,15.95) 73.25,15.95 73.91,16.61 73.91,17.74 74.33,18.17 74.33,30.66 73.87,31.12 73.87,32.21 74.43,32.77 74.43,34.21 v2(74.27,34.37)
CH1_OUT: length 36.7
  Top Layer w0.254: v2(71.98,9.6) 69.64,9.6 R17.1 ; v2(72.57,37.42) 72.25,37.74 U10.68
  Bottom Layer w0.254: v2(72.57,37.42) 72.83,37.16 72.83,36.2 72.46,35.84 72.46,33.28 71.35,32.16 71.35,18.71 71.81,18.24 71.81,16.51 71.58,16.28 71.58,15.63 71.81,15.39 71.81,15.25 72.83,14.23 72.83,9.94 72.49,9.6 v2(71.98,9.6)
COM3: length 75.4
  Top Layer w0.254: 29.66,35.38 29.66,28.43 40.79,17.3 v2(69.7,17.3) ; 71.28,39.02 U10.66 ; 71.15,39.02 71.15,36.48 v2(70.89,36.22)
  Bottom Layer w0.254: v2(69.7,17.3) 70.89,18.49 v2(70.89,36.22)
DBG_SWCLK: length 78.1
  Top Layer w0.254: v2(60.05,64.47) 61.65,66.07 H9.5 ; U2.6 7.28,81.7 v2(8.2,81.7) ; v2(7.47,66.12) v2(56.36,66.12)
  Bottom Layer w0.254: v2(60.05,64.47) 60.05,65.11 59.03,66.12 v2(56.36,66.12) ; v2(8.2,81.7) 8.2,68.03 7.21,67.04 7.21,66.37 v2(7.47,66.12)
DBG_SWDIO: length 74.6
  Top Layer w0.254: v2(6.45,67.39) v2(56.24,67.39) ; H9.7 62.92,65.69 v2(61.44,64.21) ; v2(7.29,78.3) 5.89,78.3 U2.7
  Bottom Layer w0.254: v2(61.44,64.21) 58.27,67.39 v2(56.24,67.39) ; v2(7.29,78.3) 7.29,68.23 v2(6.45,67.39)
EN_GSM_PWR: length 59
  Top Layer w0.254: v2(82.73,44.07) 82.73,44.31 81.4,42.99 U10.2 ; v2(82.47,70.76) 78.39,70.76 v2(77.83,71.32)
  Bottom Layer w0.254: v2(82.73,44.07) 82.73,45.98 83.29,46.54 83.29,60.83 82.37,61.74 82.37,68.41 82.68,68.71 82.68,69.36 82.37,69.67 82.37,70.39 82.47,70.49 v2(82.47,70.76) ; U8.10 79.6,92.15 80.87,90.88 80.87,89.23 77.83,86.18 v2(77.83,71.32)
EXT_INTP: length 49.6
  Top Layer w0.254: v2(31.72,74.88) 34.17,72.43 R6.1 ; U2.8 2.78,76.03 2.64,75.9 2.64,68.91 2.82,68.73 v2(31.85,68.73)
  Bottom Layer w0.254: v2(31.85,68.73) 31.85,74.75 v2(31.72,74.88)
GPIO2: length 54
  Top Layer w0.254: v2(78.46,47.83) 78.5,47.79 78.5,47.39 77.56,46.45 77.56,45.32 79.33,43.55 79.44,43.55 79.5,43.49 U10.3
  Bottom Layer w0.254: U8.8 83.16,91.7 83.87,91.7 84.05,91.52 84.05,86.35 81.1,83.41 81.1,64.98 79.98,63.86 79.98,56.44 78.86,55.31 78.86,47.77 78.52,47.77 v2(78.46,47.83)
GPIO3: length 80.6
  Top Layer w0.254: v2(44.3,39.95) 45.06,39.19 55.66,39.19 56.04,39.57 56.69,39.57 57.07,39.19 57.76,39.19 59.03,40.46 59.16,40.46 59.17,40.47 67.03,40.47 68.38,41.82 71.56,41.82 72.06,42.32 72.78,42.32 73.54,43.08 v2(76.98,43.08) ; R6.2 v2(40.49,72.43) ; U10.4 79.93,43.9 79.48,43.9 78.85,44.53 78.85,44.64 78.34,45.15 v2(78.34,46.12)
  Bottom Layer w0.254: v2(78.34,46.12) 77.85,45.63 77.85,45.6 77.39,45.14 77.36,45.14 76.55,44.32 76.55,43.13 76.6,43.08 v2(76.98,43.08) ; v2(40.49,72.43) 44.3,68.62 v2(44.3,39.95)
HFXIN: length 45
  Top Layer w0.254: v2(85.7,46.56) 85.7,46.49 84.24,46.49 83.74,46.99 U10.10 ; v2(91.54,22.94) 93.26,21.21 C7.2 ; v2(82.65,28.65) 84.18,27.13 X1.2 89.92,27.13 v2(91.8,29.01)
  Bottom Layer w0.254: v2(85.7,46.56) 85.7,46.02 85.42,45.74 85.42,45.09 85.7,44.81 85.7,44.27 83.67,42.24 83.67,36.36 83.92,36.1 83.92,33.13 83.67,32.88 83.67,29.67 v2(82.65,28.65) ; v2(91.54,22.94) 91.8,23.19 v2(91.8,29.01)
HFXOUT: length 43.7
  Top Layer w0.254: U10.11 84.49,47.47 v2(84.68,47.28) ; v2(88.49,17.73) 90.3,17.73 R11.2
  Bottom Layer w0.254: v2(84.68,47.28) 84.68,44.02 83.29,42.62 83.29,36.24 83.57,35.96 83.57,33.28 83.08,32.79 82.35,32.79 81.13,31.57 81.13,30.4 81.52,30 81.52,29.35 81.13,28.96 81.13,28.47 83.31,26.29 83.31,20.75 86.33,17.73 v2(88.49,17.73)
LCD1: length 65.8
  Top Layer w0.254: U10.51 66.18,46.98 65.63,46.43 24.13,46.43 8.05,62.51
LCD2: length 63.2
  Top Layer w0.254: 10.59,62.51 26.26,46.84 65.52,46.84 66.17,47.49 U10.50
LCD3: length 60.5
  Top Layer w0.254: U10.49 66.15,47.98 65.37,47.19 28.45,47.19 13.13,62.51
LCD4: length 57.9
  Top Layer w0.254: U10.48 66.16,48.49 65.25,47.57 30.61,47.57 15.67,62.51
LCD5: length 55.4
  Top Layer w0.254: U10.47 66.16,48.99 65.13,47.96 33.02,47.96 18.21,62.76
LCD6: length 52.6
  Top Layer w0.254: U10.46 66.15,49.49 65,48.34 34.92,48.34 20.75,62.51
LCD7: length 49.9
  Top Layer w0.254: 23.29,62.51 37.03,48.77 64.79,48.77 66.01,49.99 U10.45
LCD8: length 47.3
  Top Layer w0.254: 25.83,62.51 39.22,49.12 64.64,49.12 66.02,50.51 U10.44
LCD9: length 44.7
  Top Layer w0.254: 28.37,62.51 41.4,49.48 64.49,49.48 66.01,51 66.99,51 U10.43
LCD10: length 42
  Top Layer w0.254: 30.91,62.51 43.56,49.86 64.24,49.86 65.89,51.51 66.97,51.51 U10.42
LCD11: length 49.6
  Top Layer w0.254: 33.45,62.51 35.69,64.74 56.61,64.74 57.19,65.33 v2(58.65,65.33) ; U10.40 68.18,52.91 v2(58.39,52.91)
  Bottom Layer w0.254: v2(58.65,65.33) 58.65,54.21 58.27,53.83 58.27,53.04 v2(58.39,52.91)
LCD12: length 45.4
  Top Layer w0.254: U10.39 69.26,54.11 68.68,54.69 67.41,54.69 66.9,54.18 v2(57.51,54.18) ; 35.99,63.02 35.99,63.27 37.09,64.36 57.4,64.36 v2(57.51,64.47)
  Bottom Layer w0.254: v2(57.51,64.47) v2(57.51,54.18)
LCD13: length 36.9
  Top Layer w0.254: v2(52.17,57.48) 43.56,57.48 38.53,62.51 ; U10.38 69.76,53.49 69.76,54.37 69.06,55.07 v2(52.17,55.07)
  Bottom Layer w0.254: v2(52.17,57.48) v2(52.17,55.07)
LCD14: length 35.3
  Top Layer w0.254: v2(53.06,56.08) 69.44,56.08 70.26,55.27 U10.37 ; 41.07,62.51 45.21,58.37 v2(53.06,58.37)
  Bottom Layer w0.254: v2(53.06,58.37) v2(53.06,56.08)
LCD15: length 33.9
  Top Layer w0.254: 53.82,56.97 69.95,56.97 70.76,56.17 U10.36 ; 43.61,62.51 46.86,59.26 v2(53.95,59.26)
  Bottom Layer w0.254: v2(53.95,59.26) v2(53.95,56.97)
LCD16: length 32.2
  Top Layer w0.254: 46.15,62.51 48.26,60.4 54.84,60.4 54.71,60.27 v2(54.71,60.15) ; U10.35 71.26,56.43 70.21,57.48 55.19,57.48 v2(54.81,57.86)
  Bottom Layer w0.254: v2(54.71,60.15) 54.81,60.05 v2(54.81,57.86)
LCD17: length 38.3
  Top Layer w0.254: v2(55.6,61.04) 50.16,61.04 48.69,62.51 ; U10.55 66.57,44.99 65.76,45.8 53.44,45.8 v2(53.19,45.54)
  Bottom Layer w0.254: v2(55.6,61.04) 55.6,47.96 v2(53.19,45.54)
LCD18: length 42.6
  Top Layer w0.254: v2(56.62,61.93) 56.49,61.8 55.95,61.8 55.93,61.82 55.27,61.82 55.25,61.8 52.17,61.8 51.46,62.51 51.23,62.51 ; v2(59.41,38.41) 60.32,39.32 68.95,39.32 69.26,39.63 U10.62
  Bottom Layer w0.254: v2(56.62,61.93) 56.36,61.67 56.36,61.39 56.51,61.24 56.51,45.09 56.62,44.99 56.62,39.96 57.36,39.22 57.65,39.22 58.46,38.41 v2(59.41,38.41)
LCD19: length 59
  Top Layer w0.254: U10.63 69.76,39.63 68.52,38.39 68.52,38.37 68.28,38.12 v2(68.28,36.91) ; U13.19 36.8,35.67 36.8,30.05 43.91,22.94 v2(68.66,22.94)
  Bottom Layer w0.254: v2(68.66,22.94) 68.66,26.22 68.68,26.24 68.68,36.51 v2(68.28,36.91)
LCD20: length 64.3
  Top Layer w0.254: U13.20 34.41,35.18 34.39,35.16 34.39,28.52 41.38,21.54 v2(68.58,21.54) ; U10.64 70.24,40.48 70.24,39.61 69.55,38.91 69.55,38.28 v2(69.06,37.8)
  Bottom Layer w0.254: v2(69.06,37.8) 69.44,37.41 69.44,22.4 v2(68.58,21.54)
LCD21: length 68.7
  Top Layer w0.254: v2(69.7,20.75) 69.44,20.5 40,20.5 31.85,28.65 31.85,35.16 31.87,35.18 U13.21 ; v2(70.33,38.43) 70.33,39.19 70.76,39.62 U10.65
  Bottom Layer w0.254: v2(70.33,38.43) 70.33,37.92 70.1,37.69 70.1,21.16 v2(69.7,20.75)
LFXIN: length 40.7
  Top Layer w0.254: U10.7 83.47,45.49 v2(83.67,45.29) ; X2.2 88.66,23.32 v2(88.75,23.32) ; v2(89.38,29.79) 92.42,29.79 C9.2 ; v2(86.46,33.86) 86.18,33.58 v2(82.75,33.58)
  Bottom Layer w0.254: v2(83.67,45.29) 83.29,44.91 83.29,44.63 83.52,44.4 83.52,43.75 82.78,43.01 82.78,36.24 83.21,35.81 83.21,34.55 82.91,34.24 82.91,33.73 v2(82.75,33.58) ; v2(86.46,33.86) 89.38,30.94 v2(89.38,29.79) 90.65,28.52 90.65,25.22 v2(88.75,23.32)
LFXOUT: length 51.1
  Top Layer w0.254: v2(86.21,45.42) 85.89,45.74 84.62,45.74 84.28,46.08 80.1,46.08 U10.8 ; v2(88.87,25.35) 92.87,25.35 C8.2 92.44,24.13 80.42,24.13 80.24,23.95 80.24,23.8 X2.1
  Bottom Layer w0.254: v2(86.21,45.42) 86.21,44.15 84.43,42.37 84.43,29.79 v2(88.87,25.35)
LP_UART_RXD: length 43.7
  Top Layer w0.254: U2.3 v2(14.22,86.05) ; 14.2,73.1 29.92,73.1 34.66,68.36
  Bottom Layer w0.254: v2(14.22,86.05) 14.22,73.38 v2(14.2,73.36)
LP_UART_TXD: length 44.1
  Top Layer w0.254: R7.1 33.48,70.46 28.93,75.01 13.44,75.01 v2(13.06,75.39) ; v2(13.06,88.21) 12.89,88.05 U2.2
  Bottom Layer w0.254: v2(13.06,88.21) v2(13.06,75.39)
RESET_N: length 75.5
  Top Layer w0.254: H9.3 60.38,68.04 59.6,67.26 58.62,67.26 56.46,65.1 v2(8.48,65.1) ; v2(9.12,82.71) 6.14,82.71 U2.5
  Bottom Layer w0.254: v2(8.48,65.1) 9.12,65.74 v2(9.12,82.71)
SPI1_MISO: length 103.3
  Top Layer w0.254: v2(17.15,40.77) 17.15,40.84 17.91,41.61 45.69,41.61 47.22,40.08 55.54,40.08 55.74,40.29 56.98,40.29 57.19,40.08 57.38,40.08 58.52,41.22 65.74,41.22 v2(66.13,41.61) ; v2(7.72,12.27) 7.09,12.9 7.08,12.9 6.52,13.47 6.52,13.64 ; U10.30 73.85,53.4 73.85,52.95 73.62,52.72 73.62,51.88 72.91,51.17 v2(72.91,50.56)
  Bottom Layer w0.254: v2(66.13,41.61) 71.48,41.61 72.85,42.98 72.85,50.5 v2(72.91,50.56) ; v2(7.72,12.27) 7.72,15.83 16.89,24.99 16.89,40.36 17.15,40.62 v2(17.15,40.77)
SPI1_MOSI: length 98.7
  Top Layer w0.254: v2(6.96,18.62) 5.52,17.18 5.52,16.04 ; U10.29 74.34,53.41 74.34,52.95 74.48,52.81 v2(74.48,50.88) ; v2(74.08,44.12) 72.63,42.67 71.65,42.67 71.16,42.18 68.24,42.18 66.89,40.83 58.89,40.83 57.76,39.7 57.07,39.7 56.84,39.93 55.89,39.93 55.66,39.7 45.44,39.7 45.08,40.06 45.08,40.28 44.62,40.74 43.97,40.74 42.93,39.7 v2(15.98,39.7)
  Bottom Layer w0.254: v2(74.48,50.88) 74.08,50.47 v2(74.08,44.12) ; v2(6.96,18.62) 15.98,27.64 v2(15.98,39.7)
SPI1_NSS: length 112.3
  Top Layer w0.254: v2(9.12,12.65) 8.13,13.64 7.02,13.64 ; v2(9.12,9.6) 10.07,8.65 R14.1 ; v2(59.03,45.01) 55.78,45.01 55.4,44.63 55.38,44.65 24.36,44.65 v2(18.9,50.11) ; U10.31 73.26,52.03 v2(71.22,49.99)
  Bottom Layer w0.254: v2(59.03,45.01) 64.07,45.01 64.54,44.54 67.68,44.54 71.22,48.08 v2(71.22,49.99) ; v2(18.9,50.11) 18.9,42.67 19.76,41.8 19.76,41.15 19.79,41.13 19.79,25.35 8.99,14.55 8.99,12.78 v2(9.12,12.65) v2(9.12,9.6)
SPI1_SCK: length 116.2
  Top Layer w0.254: U10.32 72.76,52.67 v2(72.05,51.96) ; 6.02,16.04 6.02,16.53 6.56,17.07 10.44,17.07 12.24,18.87 18.77,18.87 v2(19.02,18.62) ; v2(60.93,44.22) 60.81,44.1 60.45,44.1 60.1,43.74 20.24,43.74 20.04,43.94 v2(19.79,43.94) ; R15.1 14.14,8.65 v2(13.18,9.6)
  Bottom Layer w0.254: v2(19.79,43.94) 20.12,43.61 20.12,43.43 20.55,43 20.55,20.14 v2(19.02,18.62) 18.5,18.09 15.74,18.09 14.43,16.79 14.43,16.13 14.86,15.7 14.86,12.67 13.18,11 v2(13.18,9.6) ; 72.05,52.08 72.05,48.15 68.09,44.19 61.41,44.19 61.37,44.15 60.86,44.15 v2(60.93,44.22)
UART0_RX: length 49.2
  Top Layer w0.254: v2(61.95,72.59) 62.92,71.63 H9.8 ; U2.19 38.64,88.03 39.09,87.58 39.09,85.93 40.18,84.84 55.04,84.84 v2(55.47,84.4)
  Bottom Layer w0.254: v2(61.95,72.59) 59.38,72.59 55.47,76.5 v2(55.47,84.4)
UART0_TX: length 51.1
  Top Layer w0.254: v2(61.06,71.78) 61.06,70.73 H9.6 ; v2(54.58,85.62) 39.91,85.62 39.47,86.06 39.47,89.1 38.52,90.05 U2.20
  Bottom Layer w0.254: v2(54.58,85.62) 54.58,76.4 57.51,73.48 57.51,71.78 v2(61.06,71.78)
UCA1_RXD: length 61.8
  Top Layer w0.254: v2(41.63,53.42) 43.92,51.13 v2(58.27,51.13) ; R7.2 v2(39.34,70.46) ; v2(68.3,48.79) 74.73,48.79 76.56,50.62 76.56,51.77 75.84,52.48 75.84,53.4 U10.26
  Bottom Layer w0.254: v2(39.34,70.46) 41.63,68.17 v2(41.63,53.42) ; v2(58.27,51.13) 60.61,48.79 v2(68.3,48.79)
UCA1_TXD: length 65
  Top Layer w0.254: v2(38.46,56.85) 49.28,56.85 51.85,54.28 55.91,54.28 58.07,52.12 58.72,52.12 59,52.4 67.55,52.4 68.44,51.51 69.19,51.51 v2(69.44,51.26) ; v2(68.99,47.5) 69.7,48.21 74.65,48.21 76.91,50.48 76.91,50.72 77.44,51.26 77.44,51.51 76.26,52.7 U10.25 ; v2(38.33,68.4) 38.24,68.49 R8.2
  Bottom Layer w0.254: v2(69.44,51.26) 69.57,51.13 69.57,48.21 69.39,48.03 68.88,48.03 68.62,47.77 68.62,47.51 68.63,47.5 v2(68.99,47.5) ; v2(38.33,68.4) 38.33,56.97 v2(38.46,56.85)
UCA2_RXD: length 45.5
  Top Layer w0.254: U10.20 81.36,52 81.38,52.02 81.51,52.02 v2(81.64,51.89) ; v2(78.33,69.55) 78.84,69.04 v2(81.89,69.04)
  Bottom Layer w0.254: v2(78.33,69.55) 78.33,69.7 76.56,71.48 76.56,86.96 U8.9 ; v2(81.89,69.04) 81.64,68.78 81.64,61.97 80.49,60.83 80.49,54.52 81.64,53.37 v2(81.64,51.89)
UCA2_TXD: length 46
  Top Layer w0.254: v2(78.07,49.06) 79.23,50.22 79.23,51.15 79.48,51.39 79.48,51.39 79.58,51.49 U10.19
  Bottom Layer w0.254: U8.7 82.58,89.48 82.58,87.67 79.63,84.72 79.63,56.59 78.5,55.46 78.5,49.49 v2(78.07,49.06)
UCA3_RXD: length 24.8
  Top Layer w0.254: R19.2 92.81,60.6 92.81,58.85 92.56,58.6 91.87,58.6 91.49,58.22 87.79,58.22 87.07,58.93 87.07,59.19 86.26,60 84.41,60 81.89,57.48 80.65,57.48 80.58,57.41 77.91,57.41 75.84,55.34 75.4,55.34 74.73,54.68 74.73,54.68 74.68,54.62 74.68,53.58 74.7,53.56 74.7,53.55 U10.28
UCA3_TXD: length 28.2
  Top Layer w0.254: R20.2 91.16,60.79 v2(91.16,59) ; U10.27 75.26,54.26 78.05,57.06 80.79,57.06 81.61,56.23 81.91,56.23 84.81,59.13 86.05,59.13 87.25,57.93 87.25,57.71 87.73,57.23 v2(93.83,57.23)
  Bottom Layer w0.254: v2(93.83,57.23) 92.05,59 v2(91.16,59)
UCB1SCL: length 42.9
  Top Layer w0.254: 76.27,40.49 76.37,40.38 76.37,39.95 76.88,39.45 76.88,38.66 v2(76.88,38.66) ; v2(77.12,32.41) 85.31,32.41 85.64,32.74 86.77,32.74 86.83,32.79 86.83,33.11 88.39,34.68 88.39,35.53 v2(89.38,36.53) ; R10.1 95.19,52.62 94.08,51.51 94.08,48.64 91.53,46.09 91.53,45.03 v2(91.03,44.53)
  Bottom Layer w0.254: v2(76.88,38.66) 76.81,38.59 76.81,32.72 v2(77.12,32.41) ; v2(89.38,36.53) 89.38,44.5 89.41,44.53 v2(91.03,44.53)
UCB1SDA: length 34.6
  Top Layer w0.254: v2(94.46,42.88) 94.08,43.26 v2(87.71,43.26) ; v2(94.46,45.29) 93.61,45.29 U4.5 95.19,48.48 R9.1 ; U10.75 75.76,38.59 76.72,37.63 86.12,37.63 v2(86.59,37.16)
  Bottom Layer w0.254: v2(87.71,43.26) 87.71,42.3 87.07,41.66 87.07,37.64 v2(86.59,37.16) ; v2(94.46,42.88) v2(94.46,45.29)
UCB1WC#: length 12.5
  Top Layer w0.254: U10.12 80.09,48.06 85.46,48.06 88.87,44.65 89.13,44.65 90.26,45.79 U4.7
USS_GND: length 34.4
  Top Layer w0.254: 74.25,40.96 v2(74.25,41.73) ; 74.25,40.96 73.94,41.27 73.21,41.27 73.19,41.29 72.94,41.29 72.76,41.11 U10.69 72.76,38.88 v2(73.07,38.57) ; 74.25,40.96 U10.72 ; v2(72.24,55.45) 73.32,55.45 FB21.2 ; v2(79.35,40.08) 78.65,40.08 U10.80 78.17,40.56 78.17,41.02 77.93,41.27 76.85,41.27 76.79,41.2 U10.77
  Bottom Layer w0.254: v2(74.25,41.73) 74.25,43.33 73.75,43.33 73.29,43.79 73.29,44.69 73.7,45.09 73.7,53.99 v2(72.24,55.45) ; v2(79.35,40.08) 79.35,39.57 79.25,39.47 76.58,39.47 75.67,38.56 73.08,38.56 v2(73.07,38.57)
USSXTIN: length 55.1
  Top Layer w0.254: U10.78 77.34,40.41 77.34,39.66 78.08,38.92 v2(78.08,38.56) ; C11.2 86.88,30.56 v2(78.08,30.56) ; v2(81.64,11.13) 83.16,12.65 83.99,12.65 X3.2
  Bottom Layer w0.254: v2(78.08,38.56) v2(78.08,30.56) 78.08,14.68 v2(81.64,11.13)
USSXTOUT: length 37.6
  Top Layer w0.254: U10.79 77.81,40.43 77.81,39.97 78.07,39.71 78.53,39.71 79.25,38.99 v2(79.25,38.68) ; v2(90.14,35.13) 86.59,31.57 v2(79.22,31.57) ; v2(90.27,22.81) 91.03,22.05 R12.2
  Bottom Layer w0.254: v2(90.14,35.13) 91.01,34.26 91.01,23.55 v2(90.27,22.81) ; v2(79.25,38.68) 78.87,38.3 78.87,31.93 v2(79.22,31.57)
$1N524: length 26.9
  Top Layer w0.254: v2(55.85,89.61) 55.85,89.1 58.78,86.18 ; U1.10 49.51,79.7 v2(49.38,79.83) ; R1.2 59.66,86.18 58.36,86.18
  Bottom Layer w0.254: v2(55.85,89.61) 52.55,89.61 51.28,88.34 51.28,81.74 v2(49.38,79.83)
$1N575: length 26.9
  Top Layer w0.254: U1.9 47.5,76.23 v2(47.5,75.26) ; R2.2 58.36,83.44 57.64,84.16 57.64,85.92 v2(55.47,88.09)
  Bottom Layer w0.254: v2(47.5,75.26) 51.66,75.26 52.94,76.54 52.94,85.56 v2(55.47,88.09)
$1N674: length 30
  Top Layer w0.254: C2.1 33.48,84.66 C1.1 33.48,80.11 38.2,75.39 v2(41.5,75.39) 45.38,71.51 FB14.2 ; v2(45.95,79.83) 45.01,78.9 U1.7
  Bottom Layer w0.254: v2(45.95,79.83) v2(41.5,75.39)
$1N1426: length 91.1
  Top Layer w0.254: U2.1 12.1,90.05 v2(12.17,90.12) ; FB15.2 50.54,70.99 49.82,71.7 48.8,71.7 46.52,69.42 44.17,69.42 41.27,72.31 41.27,72.76 40.81,73.22 39.61,73.22 33.87,78.95 12.41,78.95 v2(12.17,79.2) ; C4.1 33.52,96.74 32.49,95.71 30.34,95.71 C3.1 28.95,97.1 v2(12.29,97.1)
  Bottom Layer w0.254: v2(12.29,97.1) 12.17,96.98 v2(12.17,90.12) v2(12.17,79.2)
$1N4626: length 25.5
  Top Layer w0.254: X1.1 79.09,25.6 v2(80.62,25.6) ; v2(81.76,16.71) 89.8,16.71 R11.1 92.2,16.95 C6.2
  Bottom Layer w0.254: v2(81.76,16.71) 80.62,17.86 v2(80.62,25.6)
$1N4706: length 49.3
  Top Layer w0.254: v2(82.52,21.79) 82.52,20.93 83.6,19.85 90.7,19.85 R12.1 87.22,19.52 86.76,19.05 79.27,19.05 77.32,17.09 77.32,15.38 X3.1 ; C10.2 89.78,32.95 87.03,30.2 81.26,30.2 v2(80.74,29.68)
  Bottom Layer w0.254: v2(82.52,21.79) 81.41,22.91 81.41,27.69 80.74,28.36 v2(80.74,29.68)
$2N1158: length 28
  Top Layer w0.254: R16.2 22.51,8.65 FB12.1 ; 7.02,16.04 14.23,16.04 19.97,10.3 19.97,8.65 TP1.1 14.57,14.05 C14.2
$2N1163: length 18.6
  Top Layer w0.254: R16.1 18.33,8.65 v2(17.12,9.86) ; v2(15.21,16.46) 7.59,16.46 7.34,16.71 6.71,16.71 6.52,16.53 6.52,16.04
  Bottom Layer w0.254: v2(17.12,9.86) 15.21,11.76 v2(15.21,16.46)
$2N1454: length 6.5
  Top Layer w0.254: R13.1 6.27,8.64 v2(4.8,10.11) ; v2(5.94,12.52) 6.02,12.45 6.02,13.64
  Bottom Layer w0.254: v2(4.8,10.11) 4.8,11.38 v2(5.94,12.52)
$2N1962: length 30.2
  Top Layer w0.254: v2(63.09,12.9) 64.2,11.8 C15.1 ; R17.2 70.59,8.55 v2(70.59,7.19) ; v2(70.59,5.03) 63.15,5.03 v2(63.09,4.98) 61.72,4.98 61.16,5.54 61.15,5.54 56.89,9.8 U11.2
  Bottom Layer w0.254: v2(70.59,5.03) v2(70.59,7.19) ; v2(63.09,4.98) v2(63.09,12.9)
$2N1973: length 20.7
  Top Layer w0.254: R18.2 68.07,9.52 65.96,9.52 65.24,8.8 C16.1 62.06,11.81 54.26,11.81 54.08,11.63 U11.3
$2N2636: length 3.9
  Top Layer w0.254: R19.1 93.07,63.99 U12.4
$2N2645: length 3.6
  Top Layer w0.254: R20.1 91.1,64.7 U12.6
$2N2649: length 4.3
  Top Layer w0.254: U12.8 90.14,64.38 90.14,63.2 89.96,63.02 89.78,63.02 R21.1
$2N2654: length 5
  Top Layer w0.254: U12.10 89,64.25 89,63.45 88.82,63.27 88.06,63.27 R22.1
$2N2659: length 20.9
  Top Layer w0.254: R22.2 87.86,60.14 v2(87.86,59.26) ; U10.16 88.49,49.99 89.66,51.16 89.66,53.23 89.13,53.77 v2(89.13,54.81)
  Bottom Layer w0.254: v2(89.13,54.81) 89.13,57.99 v2(87.86,59.26)
$2N2676: length 21.4
  Top Layer w0.254: v2(90.27,50.62) 89.15,49.5 U10.15 ; v2(89.64,59.13) 89.64,60.34 R21.2
  Bottom Layer w0.254: v2(89.64,59.13) 90.27,58.5 v2(90.27,50.62)
$2N4131: length 106.5
  Top Layer w0.254: v2(1.24,37.8) 57.25,37.8 59.16,39.7 67.97,39.7 U10.61 68.76,41.05 69.18,41.47 71.72,41.47 72.21,41.96 72.98,41.96 73.74,42.72 76.22,42.72 76.65,42.29 77.9,42.29 79.33,40.87 79.69,40.87 80.9,39.66 85.6,39.66 C17.1 ; v2(1.5,25.48) 3.03,25.48 3.1,25.4 3.11,25.4 3.44,25.07 4.53,25.07 4.7,25.24 4.7,26.28 3.99,26.99 R23.2
  Bottom Layer w0.254: v2(1.24,37.8) 1.24,25.73 v2(1.5,25.48)
$2N4149: length 77.7
  Top Layer w0.254: v2(13.31,42.11) 14.07,42.88 60.76,42.88 61.9,44.02 62.55,44.02 63.6,45.06 64.47,45.06 65.51,44.02 U10.57 ; v2(12.55,29.41) 10.33,29.41 R25.2 4.42,29.04 R24.1
  Bottom Layer w0.254: v2(12.55,29.41) 13.31,30.18 v2(13.31,42.11)
$2N4154: length 89.7
  Top Layer w0.254: R25.1 11.12,26.37 v2(11.79,26.37) 11.79,24.2 R26.2 4.18,22.75 R27.2 ; U10.56 65.8,44.49 64.87,45.42 60.76,45.42 59.57,44.22 24.29,44.22 22.76,45.75 11.23,45.75 v2(11.15,45.67)
  Bottom Layer w0.254: v2(11.79,26.37) 11.15,27 v2(11.15,45.67)
$2N4208: length 81.6
  Top Layer w0.254: v2(5.31,31.06) 3.9,31.06 R24.2 2.39,30.04 2.39,26.62 3.25,25.76 R23.1 ; v2(5.44,41.1) 14.07,41.1 15.34,42.37 45.44,42.37 45.95,41.86 64.24,41.86 64.86,42.49 U10.60
  Bottom Layer w0.254: v2(5.44,41.1) 5.44,31.19 v2(5.31,31.06)

Small or netless copper shapes (teardrops, artwork), in the pictures only: 1 on Top Layer
